# EAGLE design test-board-128-256 (EAGLE 8.3.2)
DESIGNER: JONNEW, MWL@MIT; DESIGN_NAME: 128/256 Channel Headstage Test Board; LICENSE: CERN OHL v1.2; REVISION: 1.0
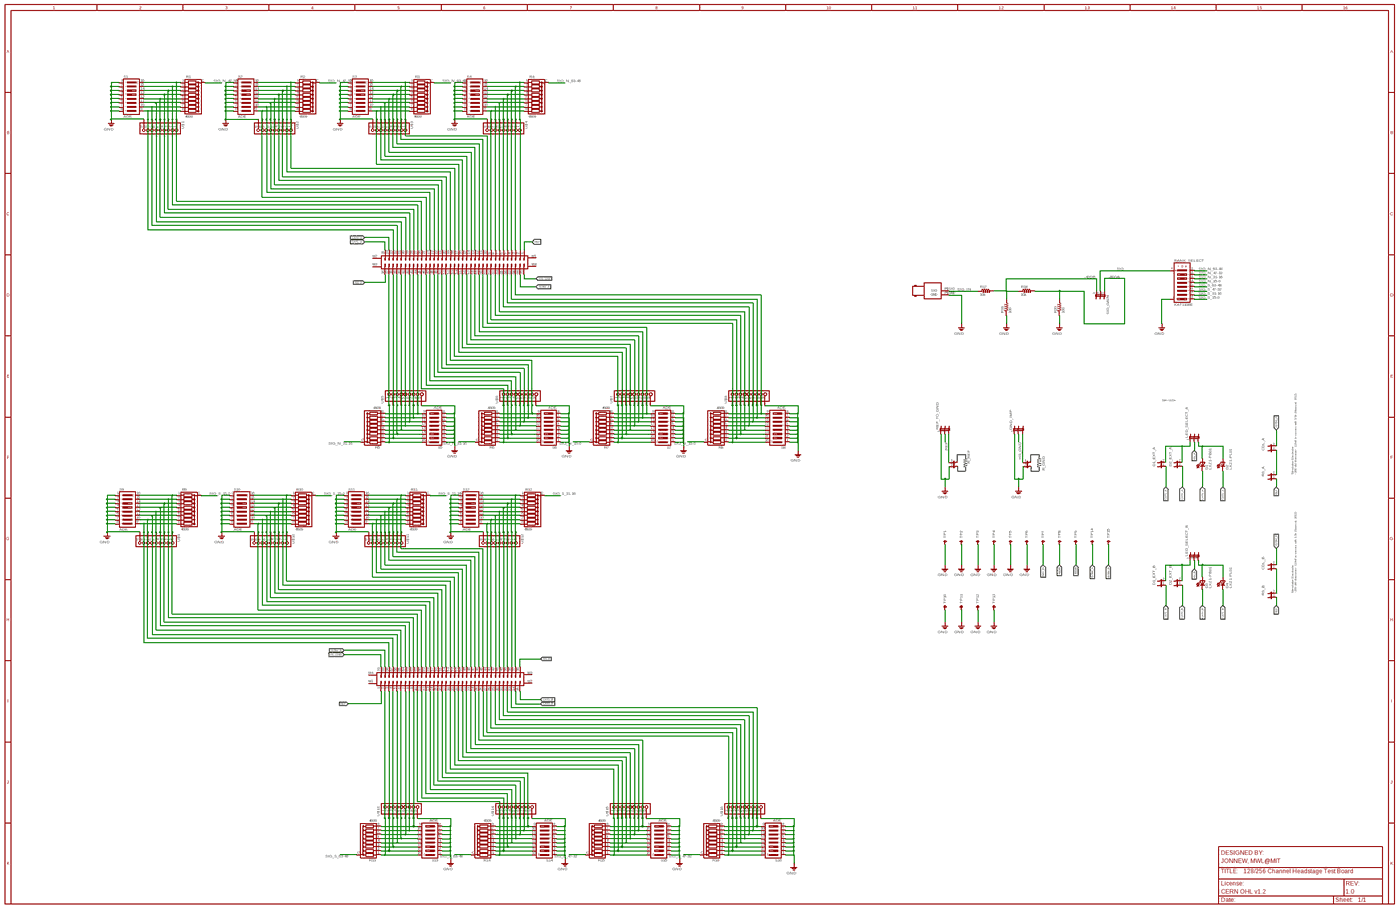
[diagram p0: schematic, sheet 1, overview]
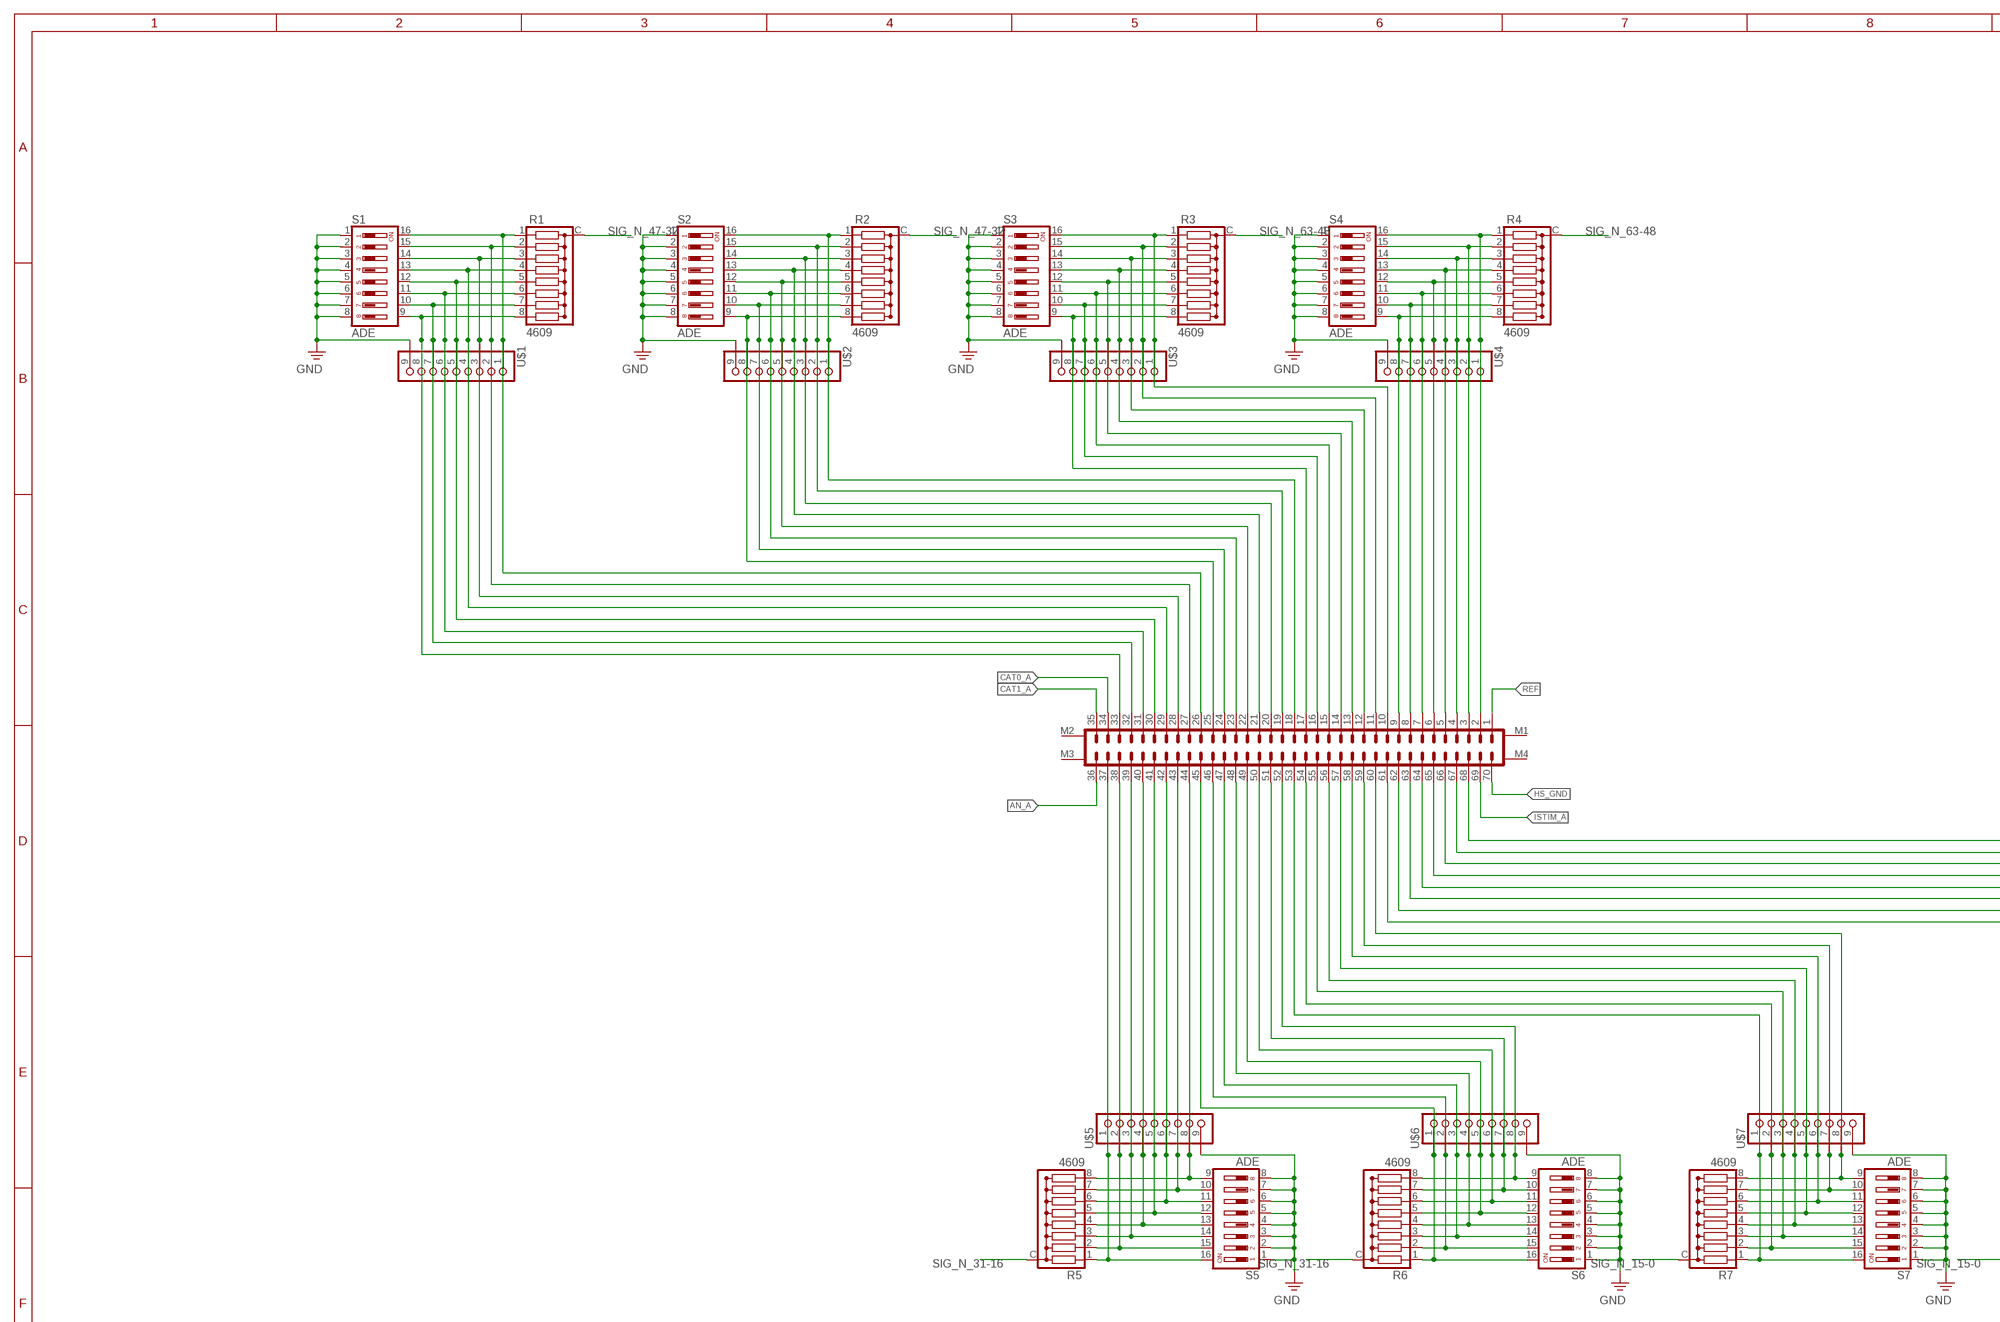
[diagram p1: schematic, sheet 1, part 1 of 4]
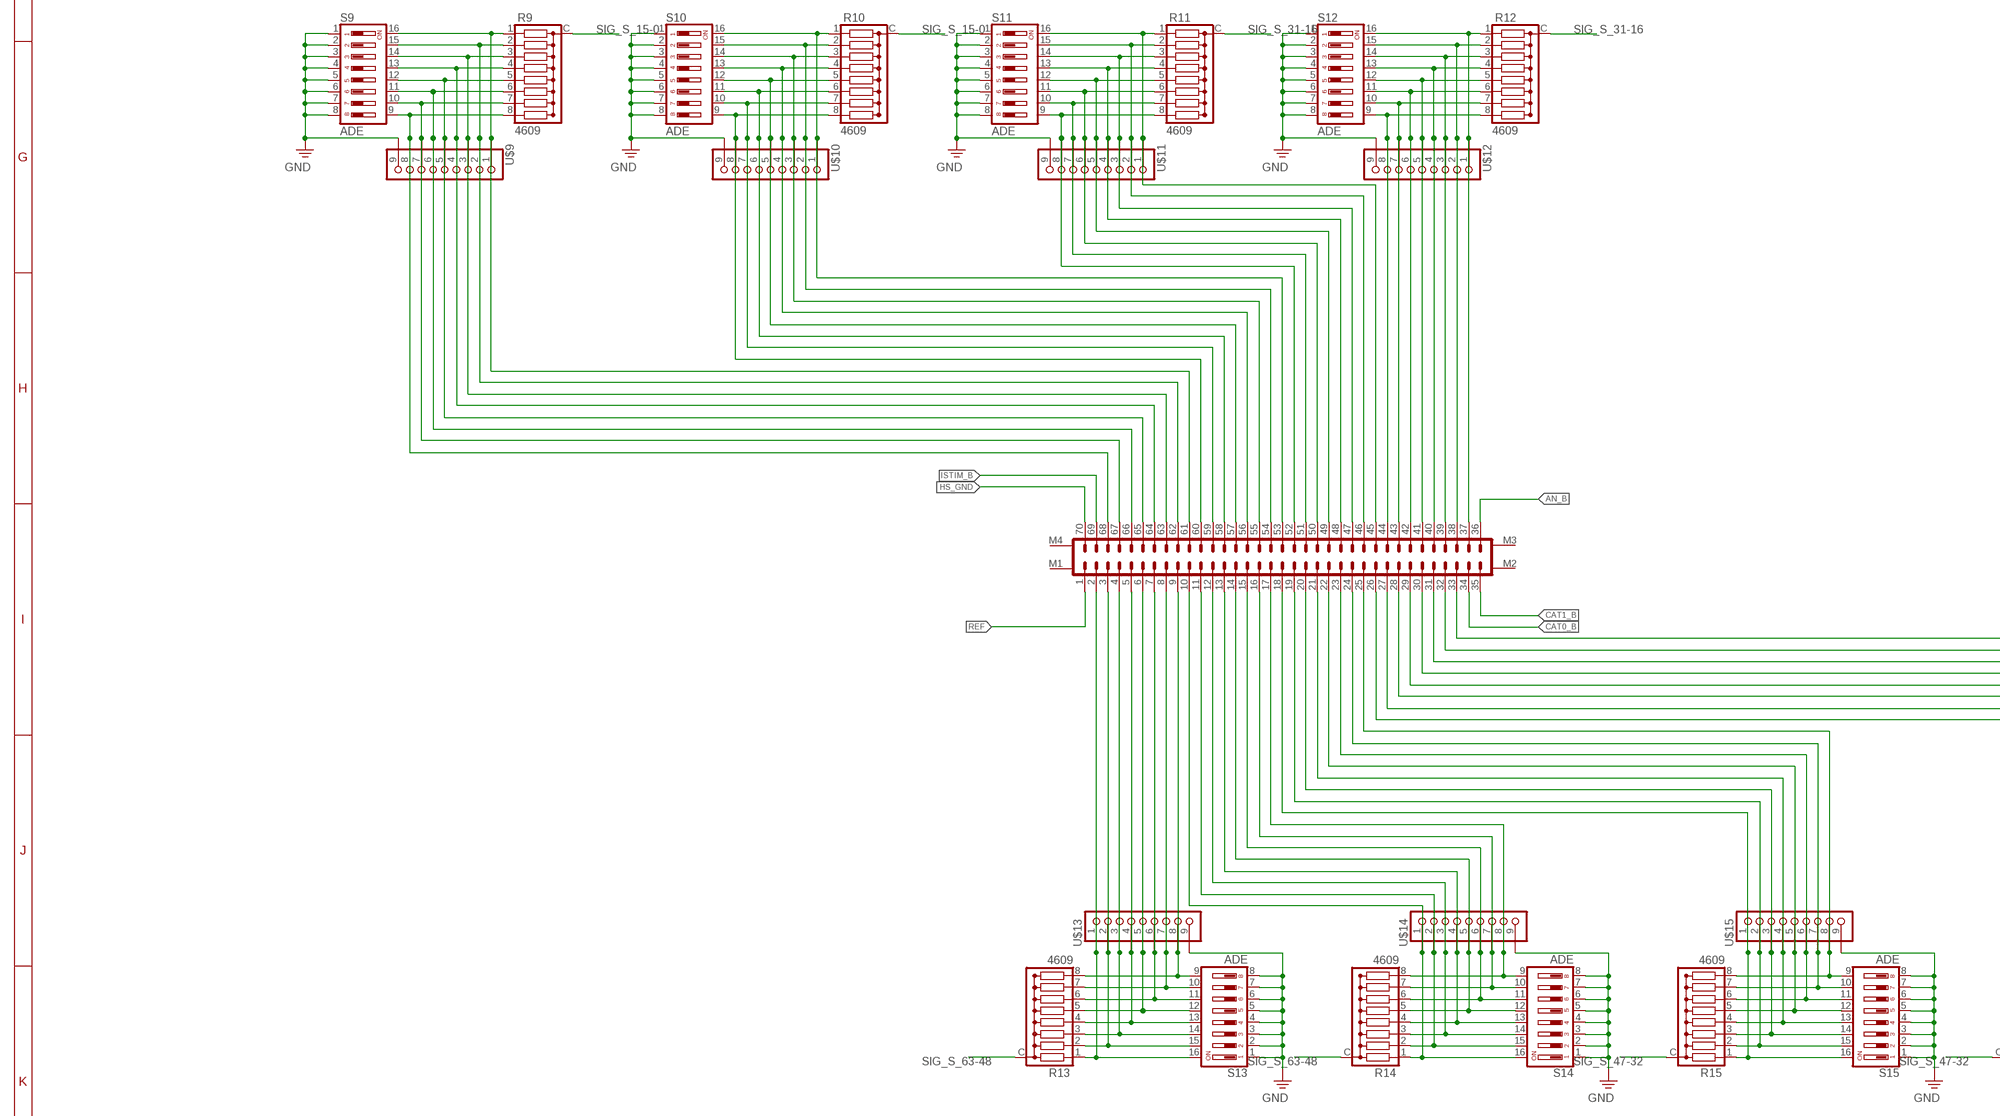
[diagram p2: schematic, sheet 1, part 2 of 4]
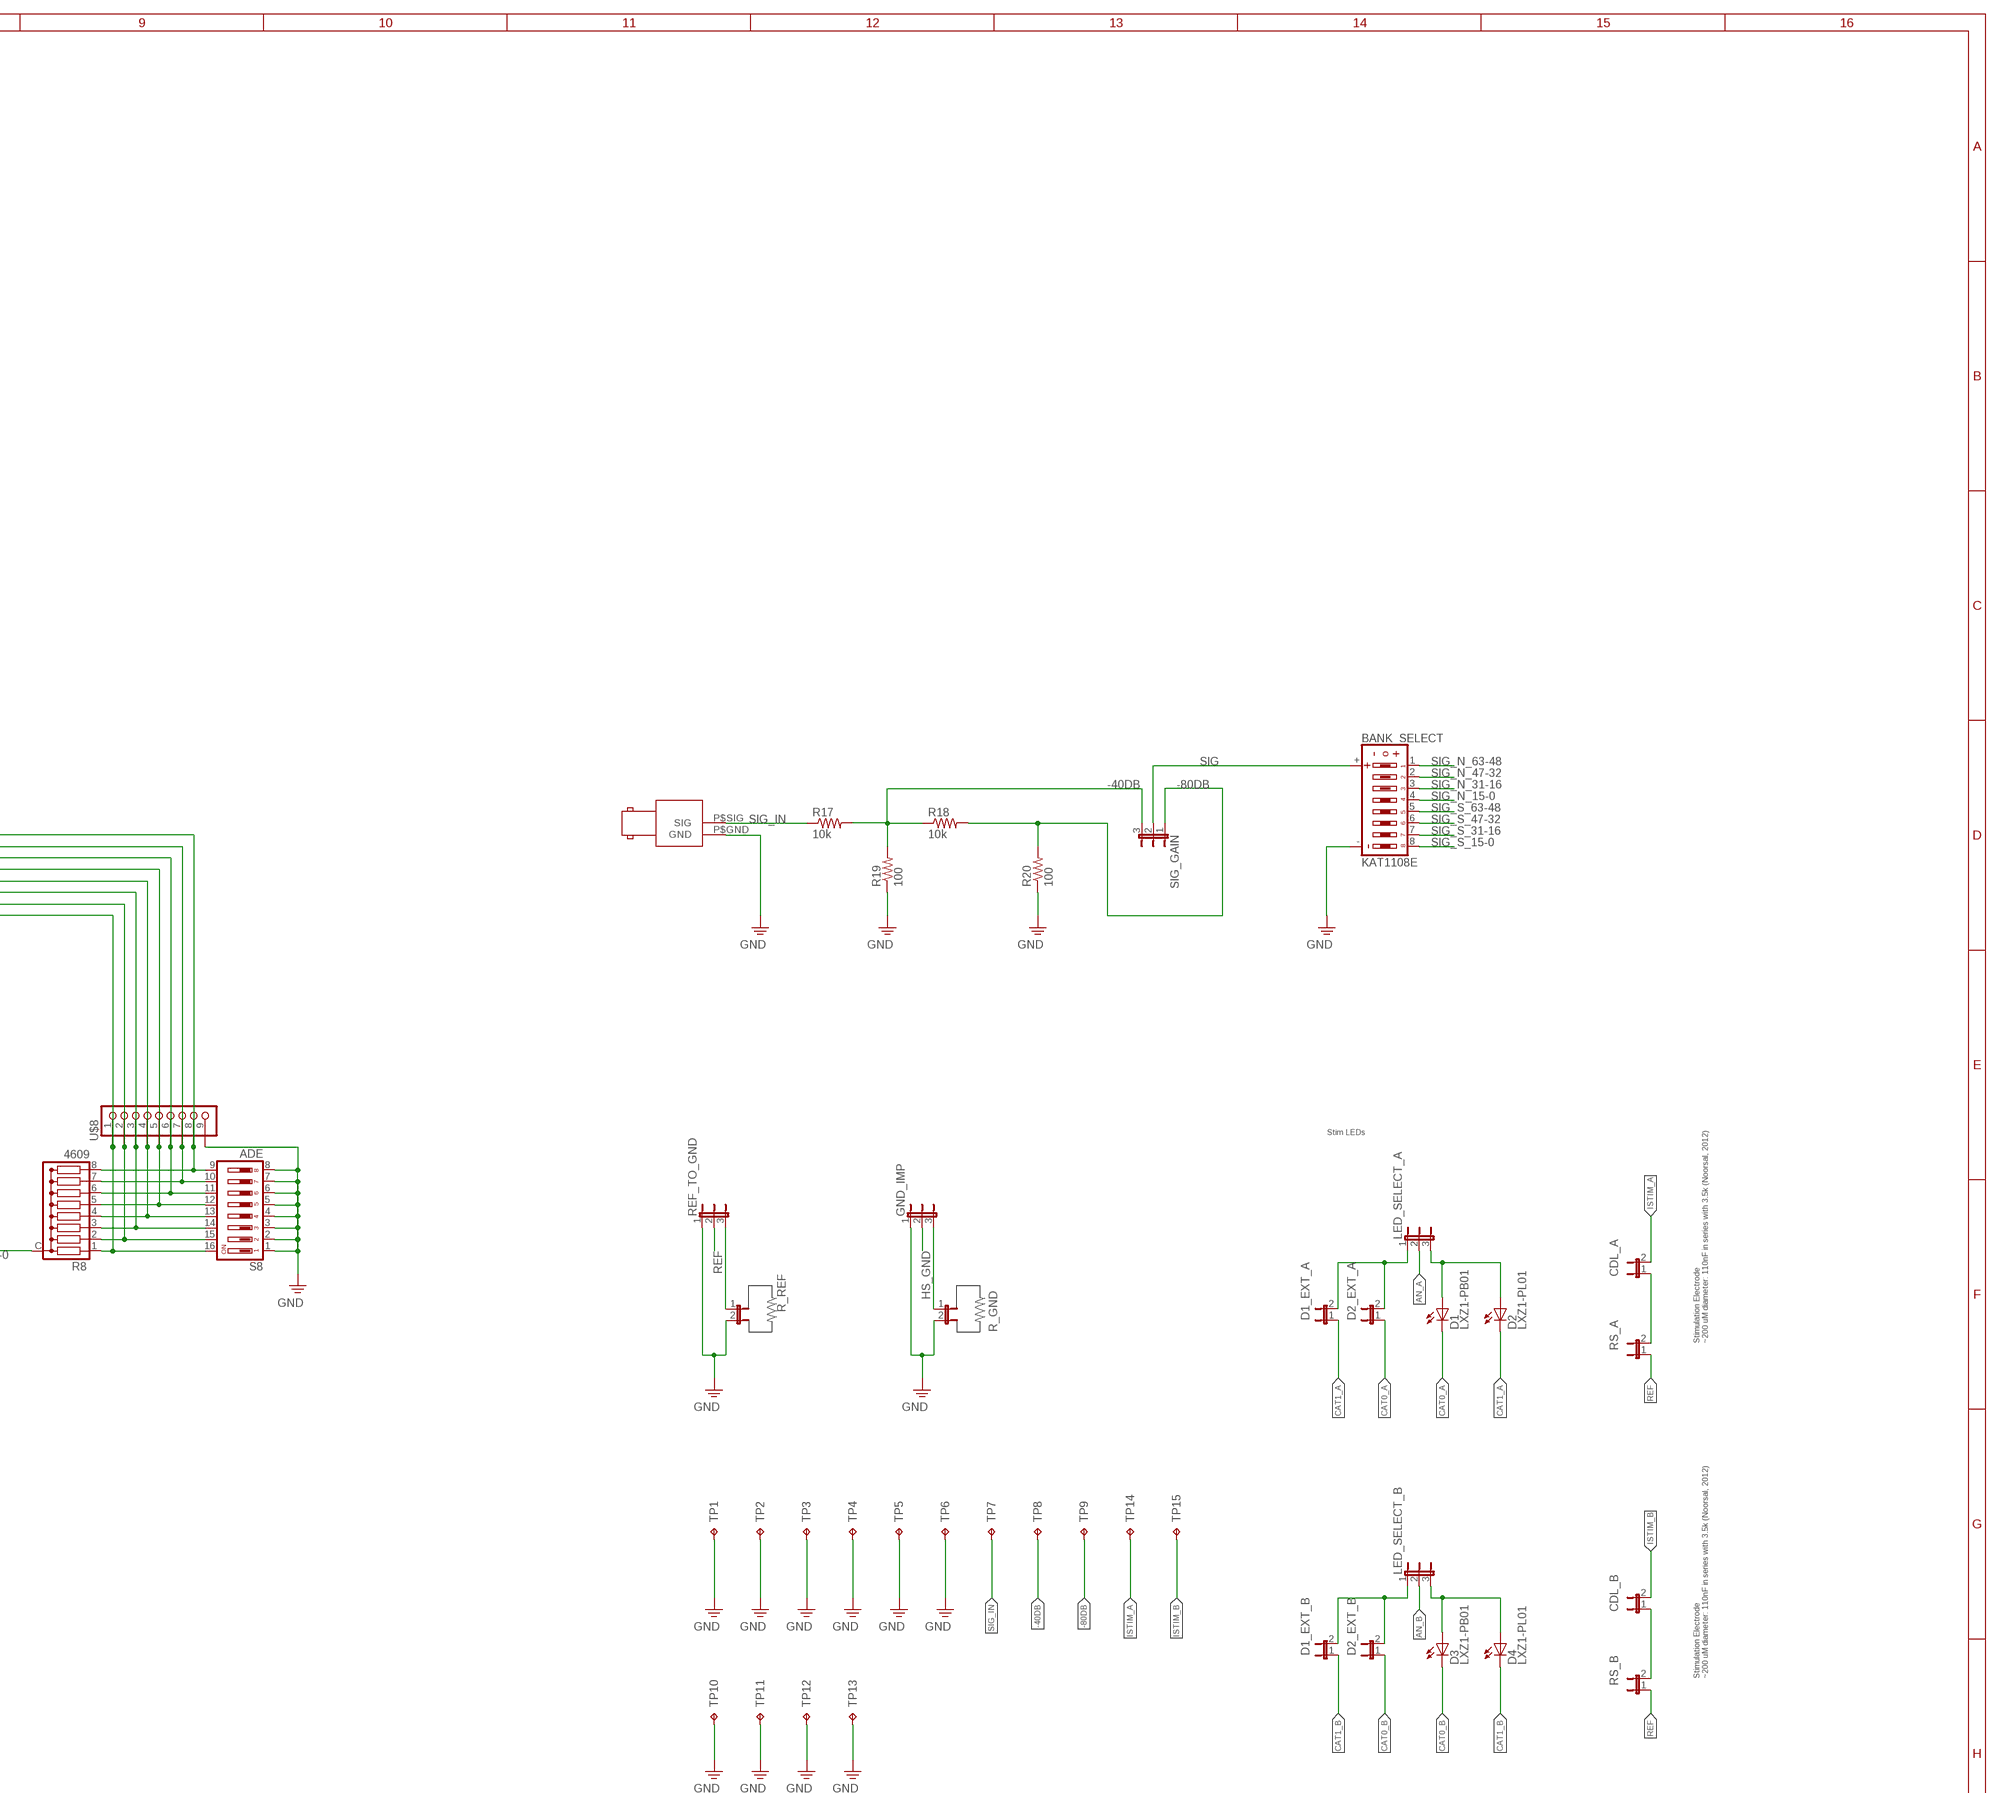
[diagram p3: schematic, sheet 1, part 3 of 4]
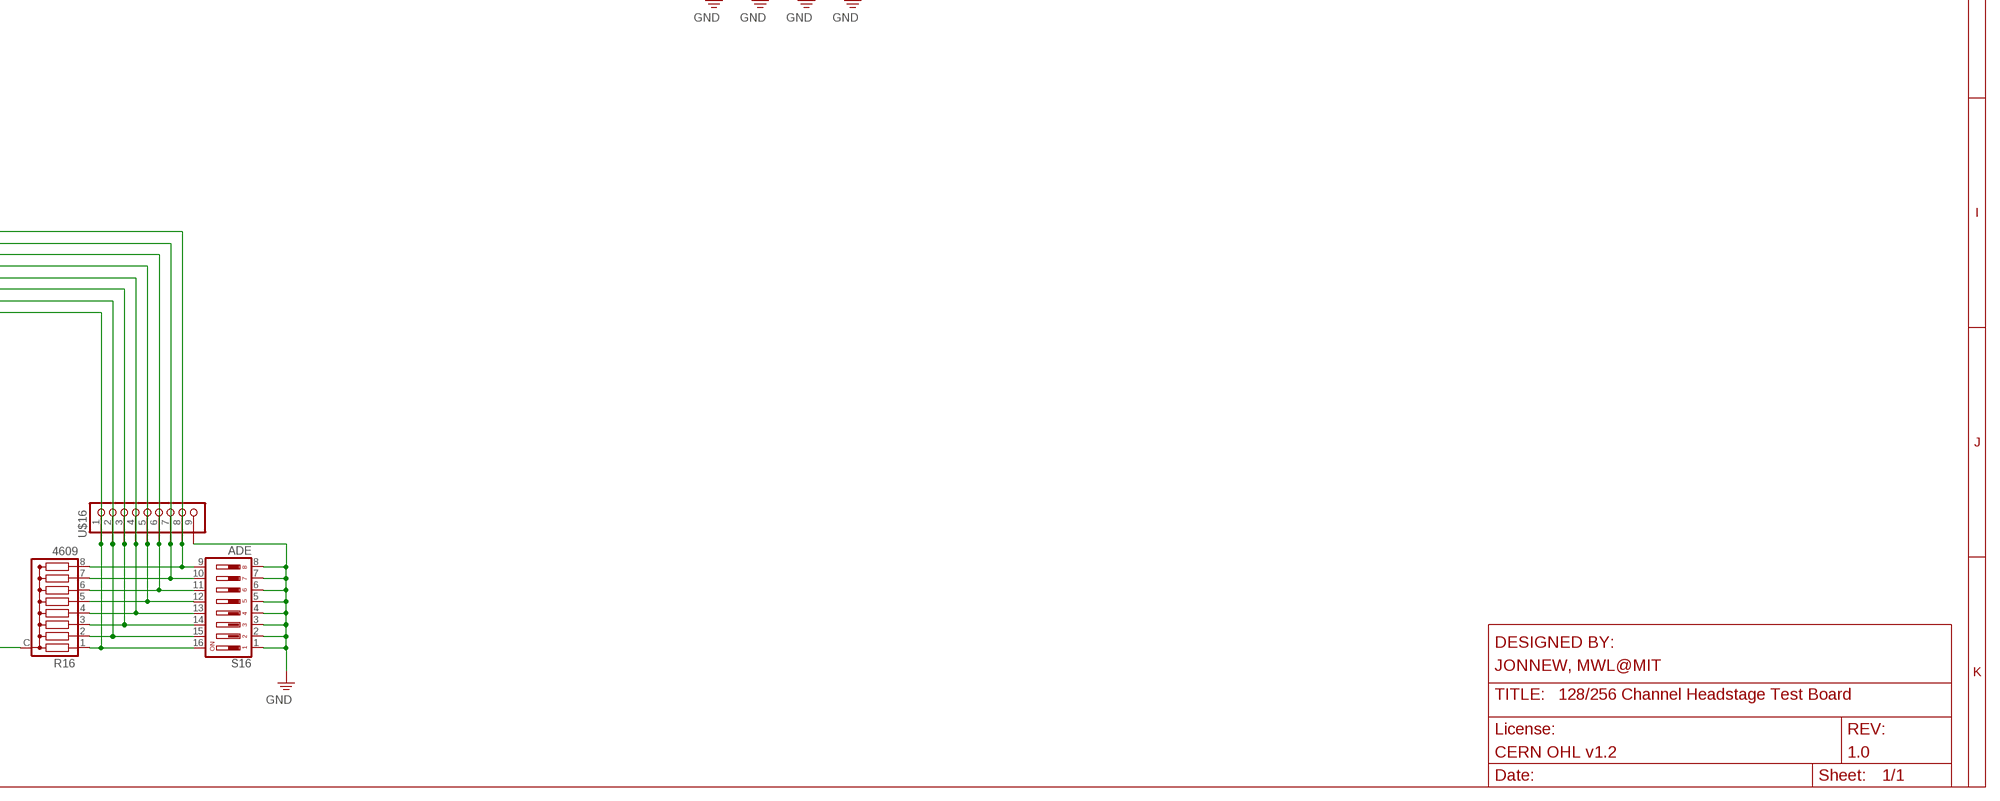
[diagram p4: schematic, sheet 1, part 4 of 4]

## Parts
A-OR-D  DF40HEAD  PINHD-2X35+4_DF40-70HEAD  [DF40-70HEAD]
B-OR-C  DF40HEAD  PINHD-2X35+4_DF40-70HEAD  [DF40-70HEAD]
BANK_SELECT  KAT1108E  DIPSW-008-SPDT_206-124  [206-124_DIP8-SPDT]
CDL_A  JP2E_THRU-HOLE  [JP2]
CDL_B  JP2E_THRU-HOLE  [JP2]
D1  LXZ1-PB01  LED_LXZ1  [LXZ1]
D1_EXT_A  JP2E_THRU-HOLE  [JP2]
D1_EXT_B  JP2E_THRU-HOLE  [JP2]
D2  LXZ1-PL01  LED_LXZ1  [LXZ1]
D2_EXT_A  JP2E_THRU-HOLE  [JP2]
D2_EXT_B  JP2E_THRU-HOLE  [JP2]
D3  LXZ1-PB01  LED_LXZ1  [LXZ1]
D4  LXZ1-PL01  LED_LXZ1  [LXZ1]
GND_IMP  JP3E  [JP3]
LED_SELECT_A  JP3E  [JP3]
LED_SELECT_B  JP3E  [JP3]
R1  4609  RN1X8  [RNX8-0.1]
R2  4609  RN1X8  [RNX8-0.1]
R3  4609  RN1X8  [RNX8-0.1]
R4  4609  RN1X8  [RNX8-0.1]
R5  4609  RN1X8  [RNX8-0.1]
R6  4609  RN1X8  [RNX8-0.1]
R7  4609  RN1X8  [RNX8-0.1]
R8  4609  RN1X8  [RNX8-0.1]
R9  4609  RN1X8  [RNX8-0.1]
R10  4609  RN1X8  [RNX8-0.1]
R11  4609  RN1X8  [RNX8-0.1]
R12  4609  RN1X8  [RNX8-0.1]
R13  4609  RN1X8  [RNX8-0.1]
R14  4609  RN1X8  [RNX8-0.1]
R15  4609  RN1X8  [RNX8-0.1]
R16  4609  RN1X8  [RNX8-0.1]
R17  10k  R_0805  [0805]
R18  10k  R_0805  [0805]
R19  100  R_0805  [0805]
R20  100  R_0805  [0805]
R_GND  JP2E_THRU-HOLE  [JP2]
R_REF  JP2E_THRU-HOLE  [JP2]
REF_TO_GND  JP3E  [JP3]
RS_A  JP2E_THRU-HOLE  [JP2]
RS_B  JP2E_THRU-HOLE  [JP2]
S1  ADE  DIPSW-008_ADE  [ADE_DIP8-SPST]
S2  ADE  DIPSW-008_ADE  [ADE_DIP8-SPST]
S3  ADE  DIPSW-008_ADE  [ADE_DIP8-SPST]
S4  ADE  DIPSW-008_ADE  [ADE_DIP8-SPST]
S5  ADE  DIPSW-008_ADE  [ADE_DIP8-SPST]
S6  ADE  DIPSW-008_ADE  [ADE_DIP8-SPST]
S7  ADE  DIPSW-008_ADE  [ADE_DIP8-SPST]
S8  ADE  DIPSW-008_ADE  [ADE_DIP8-SPST]
S9  ADE  DIPSW-008_ADE  [ADE_DIP8-SPST]
S10  ADE  DIPSW-008_ADE  [ADE_DIP8-SPST]
S11  ADE  DIPSW-008_ADE  [ADE_DIP8-SPST]
S12  ADE  DIPSW-008_ADE  [ADE_DIP8-SPST]
S13  ADE  DIPSW-008_ADE  [ADE_DIP8-SPST]
S14  ADE  DIPSW-008_ADE  [ADE_DIP8-SPST]
S15  ADE  DIPSW-008_ADE  [ADE_DIP8-SPST]
S16  ADE  DIPSW-008_ADE  [ADE_DIP8-SPST]
SIG_GAIN  JP3E  [JP3]
SIG_IN  1-1634622-0  BNC_RIGHT_ANGLE  [BNC_RIGHT_ANGLE]
TP1  GND  TPPAD1-20  [P1-20]
TP2  GND  TPPAD1-20  [P1-20]
TP3  GND  TPPAD1-20  [P1-20]
TP4  GND  TPPAD1-20  [P1-20]
TP5  GND  TPPAD1-20  [P1-20]
TP6  GND  TPPAD1-20  [P1-20]
TP7  SIG_IN  TPPAD1-20  [P1-20]
TP8  -40dB  TPPAD1-20  [P1-20]
TP9  -80dB  TPPAD1-20  [P1-20]
TP10  TP_4-40  [4-40_PLATED]
TP11  TP_4-40  [4-40_PLATED]
TP12  TP_4-40  [4-40_PLATED]
TP13  TP_4-40  [4-40_PLATED]
TP14  V_ISTIM_A  TPPAD1-20  [P1-20]
TP15  V_ISTIM_B  TPPAD1-20  [P1-20]
U$1  PINHD-1X9  [1X09]
U$2  PINHD-1X9  [1X09]
U$3  PINHD-1X9  [1X09]
U$4  PINHD-1X9  [1X09]
U$5  PINHD-1X9  [1X09]
U$6  PINHD-1X9  [1X09]
U$7  PINHD-1X9  [1X09]
U$8  PINHD-1X9  [1X09]
U$9  PINHD-1X9  [1X09]
U$10  PINHD-1X9  [1X09]
U$11  PINHD-1X9  [1X09]
U$12  PINHD-1X9  [1X09]
U$13  PINHD-1X9  [1X09]
U$14  PINHD-1X9  [1X09]
U$15  PINHD-1X9  [1X09]
U$16  PINHD-1X9  [1X09]

## Nets
-40DB: R17.2 R18.1 R19.2 SIG_GAIN.3 TP8.TP
-80DB: R18.2 R20.2 SIG_GAIN.1 TP9.TP
AN_A: A-OR-D.36 LED_SELECT_A.2
AN_B: B-OR-C.36 LED_SELECT_B.2
AN_INT: D1.A D2.A LED_SELECT_A.3
AN_INT1: D3.A D4.A LED_SELECT_B.3
CAT0_A: A-OR-D.34 D1.C D2_EXT_A.1
CAT0_B: B-OR-C.34 D2_EXT_B.1 D3.C
CAT1_A: A-OR-D.35 D1_EXT_A.1 D2.C
CAT1_B: B-OR-C.35 D1_EXT_B.1 D4.C
GND: BANK_SELECT.- GND_IMP.1 R19.1 R20.1 R_GND.2 R_REF.2 REF_TO_GND.1 S1.1 S1.2 S1.3 S1.4 S1.5 S1.6 S1.7 S1.8 S2.1 S2.2 S2.3 S2.4 S2.5 S2.6 S2.7 S2.8 S3.1 S3.2 S3.3 S3.4 S3.5 S3.6 S3.7 S3.8 S4.1 S4.2 S4.3 S4.4 S4.5 S4.6 S4.7 S4.8 S5.1 S5.2 S5.3 S5.4 S5.5 S5.6 S5.7 S5.8 S6.1 S6.2 S6.3 S6.4 S6.5 S6.6 S6.7 S6.8 S7.1 S7.2 S7.3 S7.4 S7.5 S7.6 S7.7 S7.8 S8.1 S8.2 S8.3 S8.4 S8.5 S8.6 S8.7 S8.8 S9.1 S9.2 S9.3 S9.4 S9.5 S9.6 S9.7 S9.8 S10.1 S10.2 S10.3 S10.4 S10.5 S10.6 S10.7 S10.8 S11.1 S11.2 S11.3 S11.4 S11.5 S11.6 S11.7 S11.8 S12.1 S12.2 S12.3 S12.4 S12.5 S12.6 S12.7 S12.8 S13.1 S13.2 S13.3 S13.4 S13.5 S13.6 S13.7 S13.8 S14.1 S14.2 S14.3 S14.4 S14.5 S14.6 S14.7 S14.8 S15.1 S15.2 S15.3 S15.4 S15.5 S15.6 S15.7 S15.8 S16.1 S16.2 S16.3 S16.4 S16.5 S16.6 S16.7 S16.8 SIG_IN.P$GND(GND) TP1.TP TP2.TP TP3.TP TP4.TP TP5.TP TP6.TP TP10.P$1(TP) TP11.P$1(TP) TP12.P$1(TP) TP13.P$1(TP) U$1.9 U$2.9 U$3.9 U$4.9 U$5.9 U$6.9 U$7.9 U$8.9 U$9.9 U$10.9 U$11.9 U$12.9 U$13.9 U$14.9 U$15.9 U$16.9
HS_GND: A-OR-D.70 B-OR-C.70 GND_IMP.2
ISTIM_A: A-OR-D.69 CDL_A.2 TP14.TP
ISTIM_B: B-OR-C.69 CDL_B.2 TP15.TP
N$1: CDL_A.1 RS_A.2
N$2: GND_IMP.3 R_GND.1
N$3: B-OR-C.3 R13.2 S13.15 U$13.2
N$4: B-OR-C.5 R13.4 S13.13 U$13.4
N$5: D1_EXT_A.2 D2_EXT_A.2 LED_SELECT_A.1
N$6: A-OR-D.17 R3.8 S3.9 U$3.8
N$7: A-OR-D.9 R4.8 S4.9 U$4.8
N$8: A-OR-D.15 R3.6 S3.11 U$3.6
N$9: A-OR-D.14 R3.5 S3.12 U$3.5
N$10: A-OR-D.3 R4.2 S4.15 U$4.2
N$11: A-OR-D.12 R3.3 S3.14 U$3.3
N$12: A-OR-D.4 R4.3 S4.14 U$4.3
N$13: A-OR-D.10 R3.1 S3.16 U$3.1
N$14: CDL_B.1 RS_B.2
N$16: D1_EXT_B.2 D2_EXT_B.2 LED_SELECT_B.1
N$18: A-OR-D.7 R4.6 S4.11 U$4.6
N$19: A-OR-D.8 R4.7 S4.10 U$4.7
N$20: A-OR-D.6 R4.5 S4.12 U$4.5
N$21: A-OR-D.2 R4.1 S4.16 U$4.1
N$23: A-OR-D.27 R1.2 S1.15 U$1.2
N$24: A-OR-D.29 R1.4 S1.13 U$1.4
N$25: A-OR-D.43 R5.7 S5.10 U$5.7
N$26: B-OR-C.7 R13.6 S13.11 U$13.6
N$27: A-OR-D.32 R1.7 S1.10 U$1.7
N$28: R_REF.1 REF_TO_GND.3
N$29: A-OR-D.30 R1.5 S1.12 U$1.5
N$30: A-OR-D.41 R5.5 S5.12 U$5.5
N$31: A-OR-D.28 R1.3 S1.14 U$1.3
N$32: B-OR-C.9 R13.8 S13.9 U$13.8
N$33: A-OR-D.39 R5.3 S5.14 U$5.3
N$34: A-OR-D.31 R1.6 S1.11 U$1.6
N$35: B-OR-C.10 R14.1 S14.16 U$14.1
N$36: A-OR-D.33 R1.8 S1.9 U$1.8
N$37: A-OR-D.37 R5.1 S5.16 U$5.1
N$38: A-OR-D.19 R2.2 S2.15 U$2.2
N$39: A-OR-D.52 R6.8 S6.9 U$6.8
N$40: A-OR-D.21 R2.4 S2.13 U$2.4
N$41: B-OR-C.11 R14.2 S14.15 U$14.2
N$42: A-OR-D.23 R2.6 S2.11 U$2.6
N$43: A-OR-D.24 R2.7 S2.10 U$2.7
N$45: B-OR-C.14 R14.5 S14.12 U$14.5
N$46: B-OR-C.15 R14.6 S14.11 U$14.6
N$47: A-OR-D.47 R6.3 S6.14 U$6.3
N$48: B-OR-C.16 R14.7 S14.10 U$14.7
N$49: B-OR-C.19 R15.2 S15.15 U$15.2
N$50: B-OR-C.20 R15.3 S15.14 U$15.3
N$51: B-OR-C.21 R15.4 S15.13 U$15.4
N$52: B-OR-C.22 R15.5 S15.12 U$15.5
N$53: B-OR-C.23 R15.6 S15.11 U$15.6
N$54: B-OR-C.24 R15.7 S15.10 U$15.7
N$55: B-OR-C.25 R15.8 S15.9 U$15.8
N$56: B-OR-C.26 R16.1 S16.16 U$16.1
N$57: A-OR-D.53 R7.1 S7.16 U$7.1
N$58: B-OR-C.27 R16.2 S16.15 U$16.2
N$59: B-OR-C.28 R16.3 S16.14 U$16.3
N$60: B-OR-C.29 R16.4 S16.13 U$16.4
N$61: B-OR-C.30 R16.5 S16.12 U$16.5
N$62: B-OR-C.31 R16.6 S16.11 U$16.6
N$63: B-OR-C.32 R16.7 S16.10 U$16.7
N$64: B-OR-C.33 R16.8 S16.9 U$16.8
N$65: B-OR-C.8 R13.7 S13.10 U$13.7
N$66: B-OR-C.6 R13.5 S13.12 U$13.5
N$67: B-OR-C.4 R13.3 S13.14 U$13.3
N$68: B-OR-C.2 R13.1 S13.16 U$13.1
N$69: B-OR-C.17 R14.8 S14.9 U$14.8
N$70: B-OR-C.12 R14.3 S14.14 U$14.3
N$71: B-OR-C.18 R15.1 S15.16 U$15.1
N$72: B-OR-C.61 R9.1 S9.16 U$9.1
N$73: B-OR-C.60 R10.8 S10.9 U$10.8
N$74: B-OR-C.57 R10.5 S10.12 U$10.5
N$75: B-OR-C.55 R10.3 S10.14 U$10.3
N$76: B-OR-C.53 R10.1 S10.16 U$10.1
N$77: B-OR-C.51 R11.7 S11.10 U$11.7
N$78: B-OR-C.48 R11.4 S11.13 U$11.4
N$79: B-OR-C.46 R11.2 S11.15 U$11.2
N$80: B-OR-C.40 R12.4 S12.13 U$12.4
N$81: B-OR-C.52 R11.8 S11.9 U$11.8
N$82: B-OR-C.50 R11.6 S11.11 U$11.6
N$83: B-OR-C.49 R11.5 S11.12 U$11.5
N$84: B-OR-C.47 R11.3 S11.14 U$11.3
N$85: B-OR-C.45 R11.1 S11.16 U$11.1
N$86: B-OR-C.67 R9.7 S9.10 U$9.7
N$87: B-OR-C.65 R9.5 S9.12 U$9.5
N$88: B-OR-C.63 R9.3 S9.14 U$9.3
N$89: B-OR-C.44 R12.8 S12.9 U$12.8
N$90: B-OR-C.38 R12.2 S12.15 U$12.2
N$91: B-OR-C.39 R12.3 S12.14 U$12.3
N$92: B-OR-C.42 R12.6 S12.11 U$12.6
N$93: B-OR-C.43 R12.7 S12.10 U$12.7
N$94: B-OR-C.41 R12.5 S12.12 U$12.5
N$95: B-OR-C.37 R12.1 S12.16 U$12.1
N$97: B-OR-C.64 R9.4 S9.13 U$9.4
N$98: B-OR-C.66 R9.6 S9.11 U$9.6
N$99: B-OR-C.68 R9.8 S9.9 U$9.8
N$100: B-OR-C.54 R10.2 S10.15 U$10.2
N$101: B-OR-C.56 R10.4 S10.13 U$10.4
N$102: B-OR-C.58 R10.6 S10.11 U$10.6
N$103: B-OR-C.59 R10.7 S10.10 U$10.7
N$110: B-OR-C.13 R14.4 S14.13 U$14.4
N$130: B-OR-C.62 R9.2 S9.15 U$9.2
N$206: A-OR-D.26 R1.1 S1.16 U$1.1
N$207: A-OR-D.25 R2.8 S2.9 U$2.8
N$210: A-OR-D.22 R2.5 S2.12 U$2.5
N$212: A-OR-D.20 R2.3 S2.14 U$2.3
N$214: A-OR-D.18 R2.1 S2.16 U$2.1
N$216: A-OR-D.16 R3.7 S3.10 U$3.7
N$219: A-OR-D.13 R3.4 S3.13 U$3.4
N$221: A-OR-D.11 R3.2 S3.15 U$3.2
N$230: A-OR-D.5 R4.4 S4.13 U$4.4
N$231: A-OR-D.38 R5.2 S5.15 U$5.2
N$233: A-OR-D.40 R5.4 S5.13 U$5.4
N$235: A-OR-D.42 R5.6 S5.11 U$5.6
N$237: A-OR-D.44 R5.8 S5.9 U$5.8
N$238: A-OR-D.45 R6.1 S6.16 U$6.1
N$239: A-OR-D.46 R6.2 S6.15 U$6.2
N$241: A-OR-D.48 R6.4 S6.13 U$6.4
N$242: A-OR-D.49 R6.5 S6.12 U$6.5
N$243: A-OR-D.50 R6.6 S6.11 U$6.6
N$245: A-OR-D.51 R6.7 S6.10 U$6.7
N$247: A-OR-D.54 R7.2 S7.15 U$7.2
N$248: A-OR-D.55 R7.3 S7.14 U$7.3
N$249: A-OR-D.56 R7.4 S7.13 U$7.4
N$250: A-OR-D.57 R7.5 S7.12 U$7.5
N$251: A-OR-D.58 R7.6 S7.11 U$7.6
N$252: A-OR-D.59 R7.7 S7.10 U$7.7
N$253: A-OR-D.60 R7.8 S7.9 U$7.8
N$254: A-OR-D.61 R8.1 S8.16 U$8.1
N$255: A-OR-D.62 R8.2 S8.15 U$8.2
N$256: A-OR-D.63 R8.3 S8.14 U$8.3
N$257: A-OR-D.64 R8.4 S8.13 U$8.4
N$258: A-OR-D.65 R8.5 S8.12 U$8.5
N$259: A-OR-D.66 R8.6 S8.11 U$8.6
N$260: A-OR-D.67 R8.7 S8.10 U$8.7
N$261: A-OR-D.68 R8.8 S8.9 U$8.8
REF: A-OR-D.1 B-OR-C.1 REF_TO_GND.2 RS_A.1 RS_B.1
SIG: BANK_SELECT.+ SIG_GAIN.2
SIG_IN: R17.1 SIG_IN.P$SIG(SIG) TP7.TP
SIG_N_15-0: BANK_SELECT.4 R7.C R8.C
SIG_N_31-16: BANK_SELECT.3 R5.C R6.C
SIG_N_47-32: BANK_SELECT.2 R1.C R2.C
SIG_N_63-48: BANK_SELECT.1 R3.C R4.C
SIG_S_15-0: BANK_SELECT.8 R9.C R10.C
SIG_S_31-16: BANK_SELECT.7 R11.C R12.C
SIG_S_47-32: BANK_SELECT.6 R15.C R16.C
SIG_S_63-48: BANK_SELECT.5 R13.C R14.C
Unconnected: A-OR-D.M1 A-OR-D.M2 A-OR-D.M3 A-OR-D.M4 B-OR-C.M1 B-OR-C.M2 B-OR-C.M3 B-OR-C.M4

## Notes on the sheet
- Stim LEDs
- Stimulation Electrode
  ~200 uM diameter: 110nF in series with 3.5k (Noorsal, 2012)
- Stimulation Electrode
  ~200 uM diameter: 110nF in series with 3.5k (Noorsal, 2012)

## Library data of the parts
A-OR-D B-OR-C = jonnew:PINHD-2X35+4
BANK_SELECT = jonnew:DIPSW-008-SPDT
CDL_A CDL_B D1_EXT_A D1_EXT_B D2_EXT_A D2_EXT_B R_GND R_REF RS_A RS_B = jonnew:JP2E
D1-D4 = jonnew:LED: Surface mount LED
GND_IMP LED_SELECT_A LED_SELECT_B REF_TO_GND SIG_GAIN = jonnew:JP3E
R1-R16 = jonnew:RN1X8
R17-R20 = jonnew:R: Resistor
S1-S16 = jonnew:DIPSW-008
SIG_IN = josh:BNC_RIGHT_ANGLE
TP1-TP15 = jonnew:TP: Test pad
U$1-U$16 = test-board:PINHD-1X9

## Net classes
1 thick: width 0.102 mm

## Board
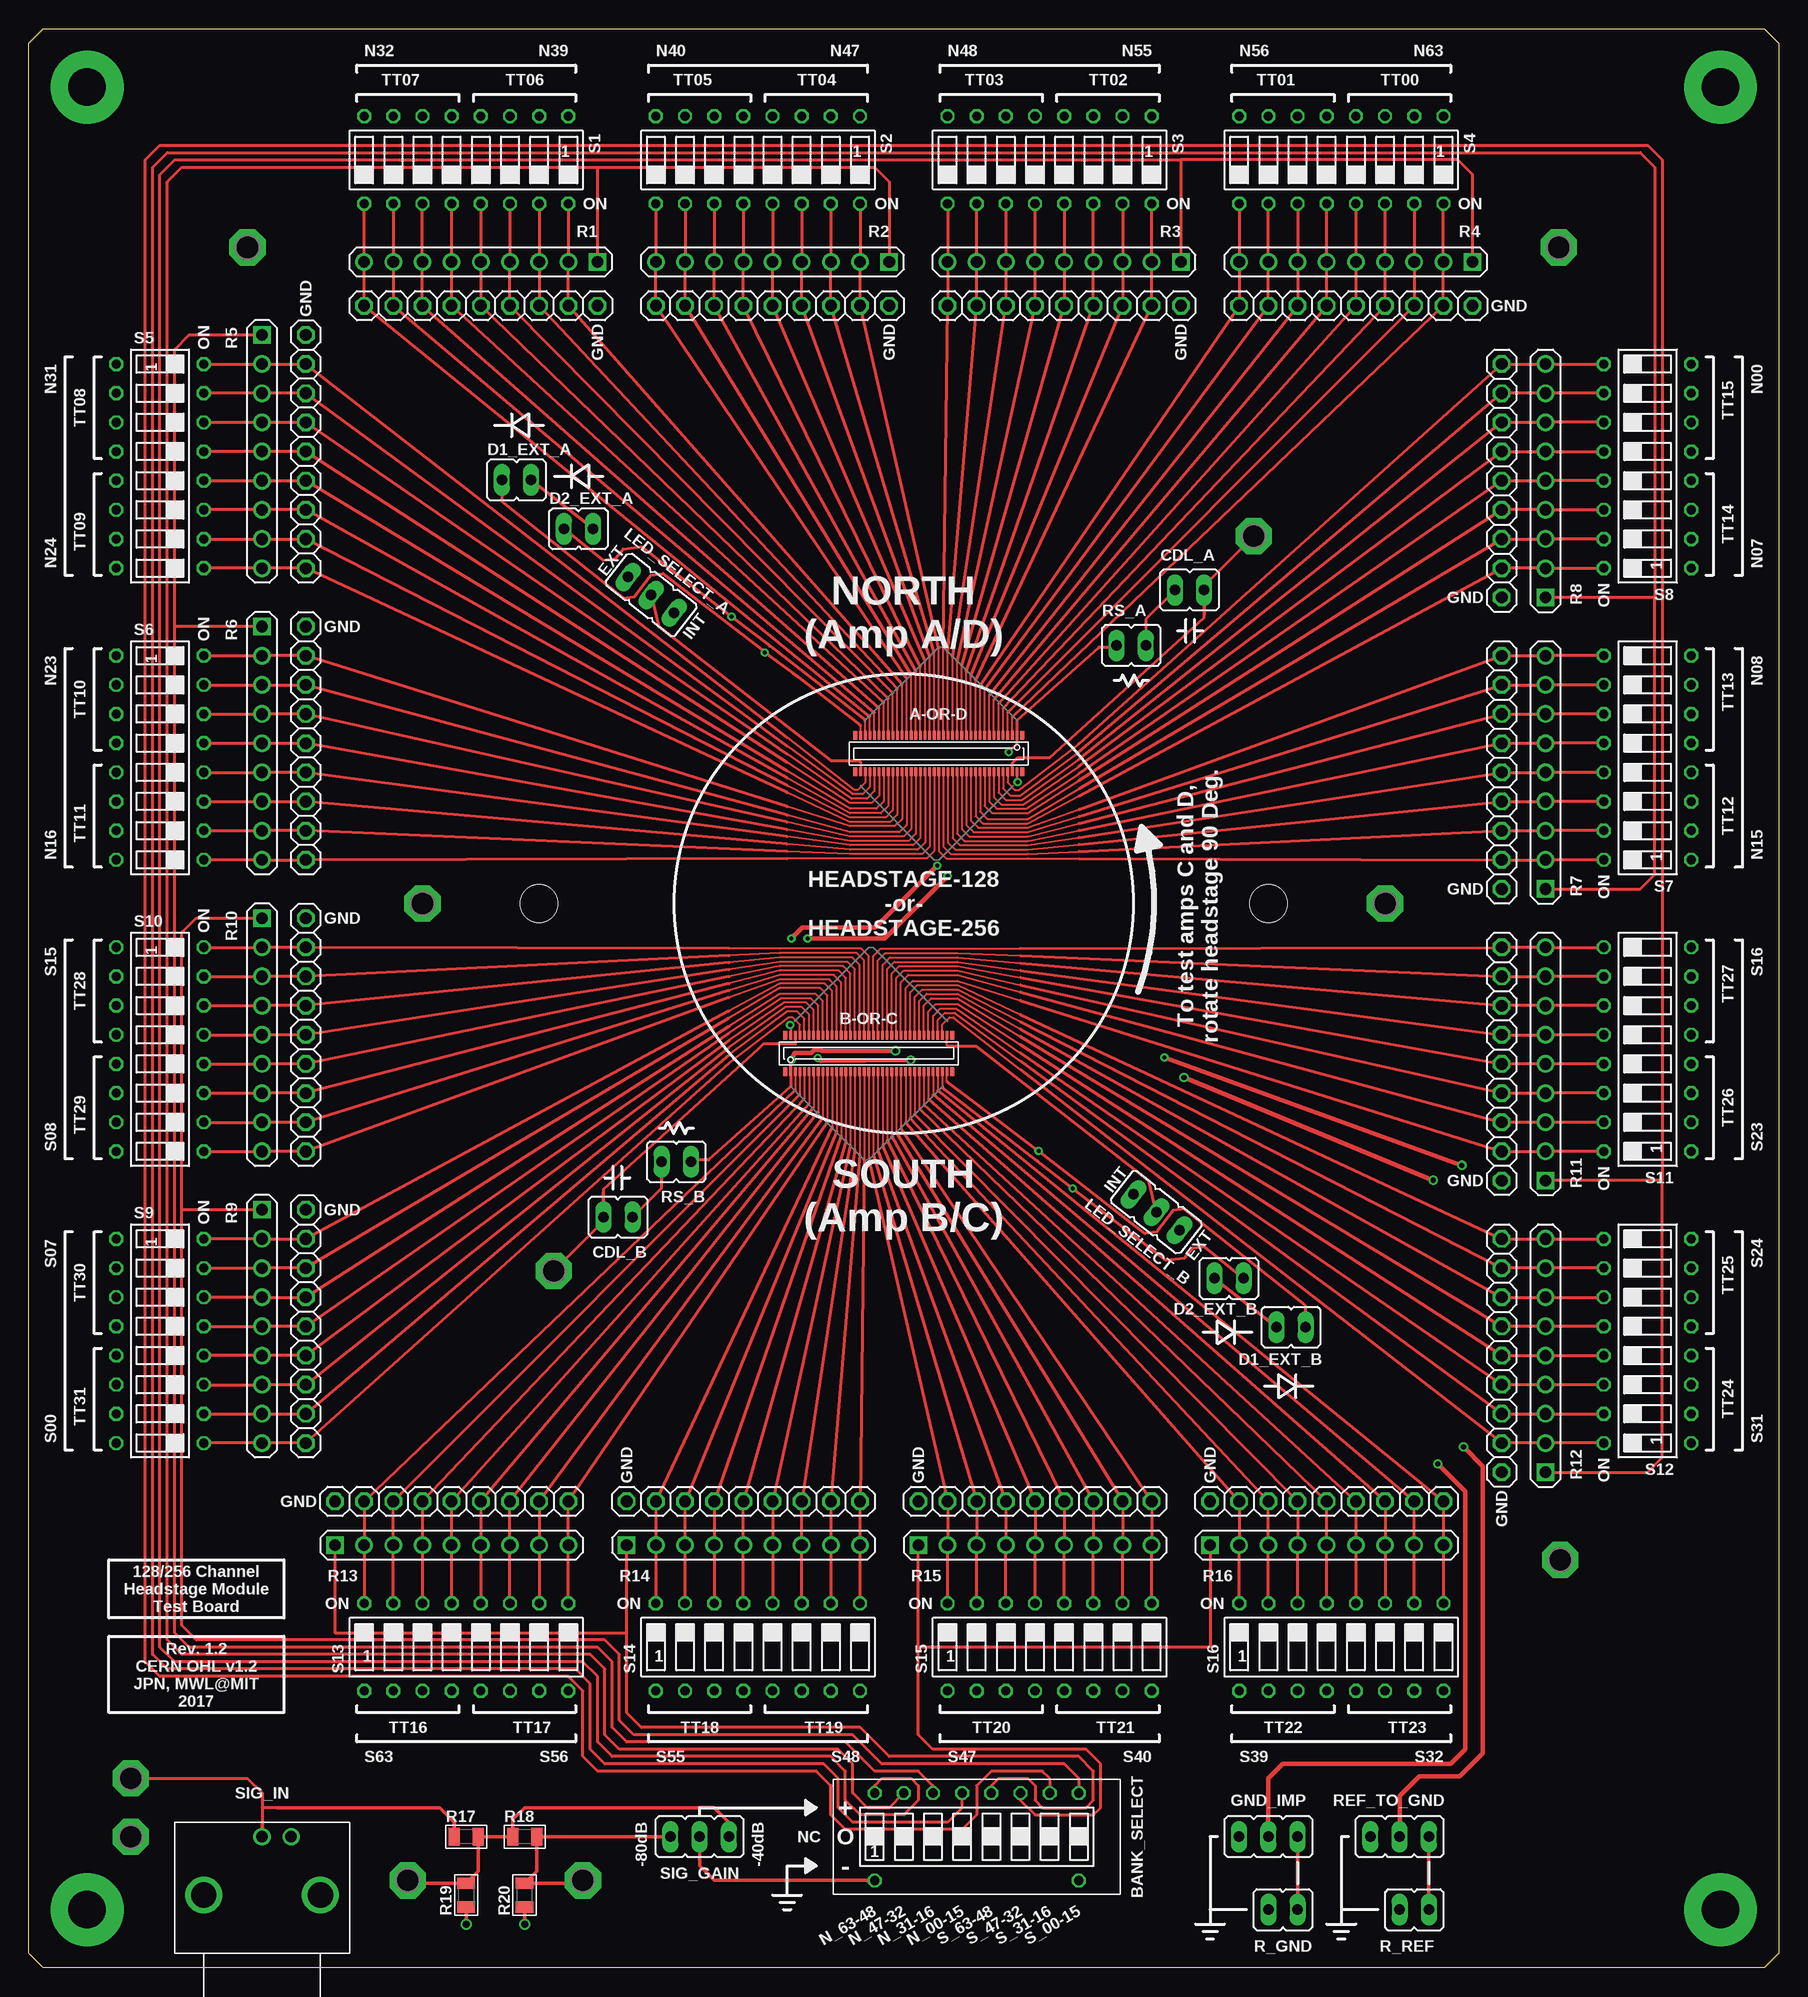
[diagram p5: board, top side]
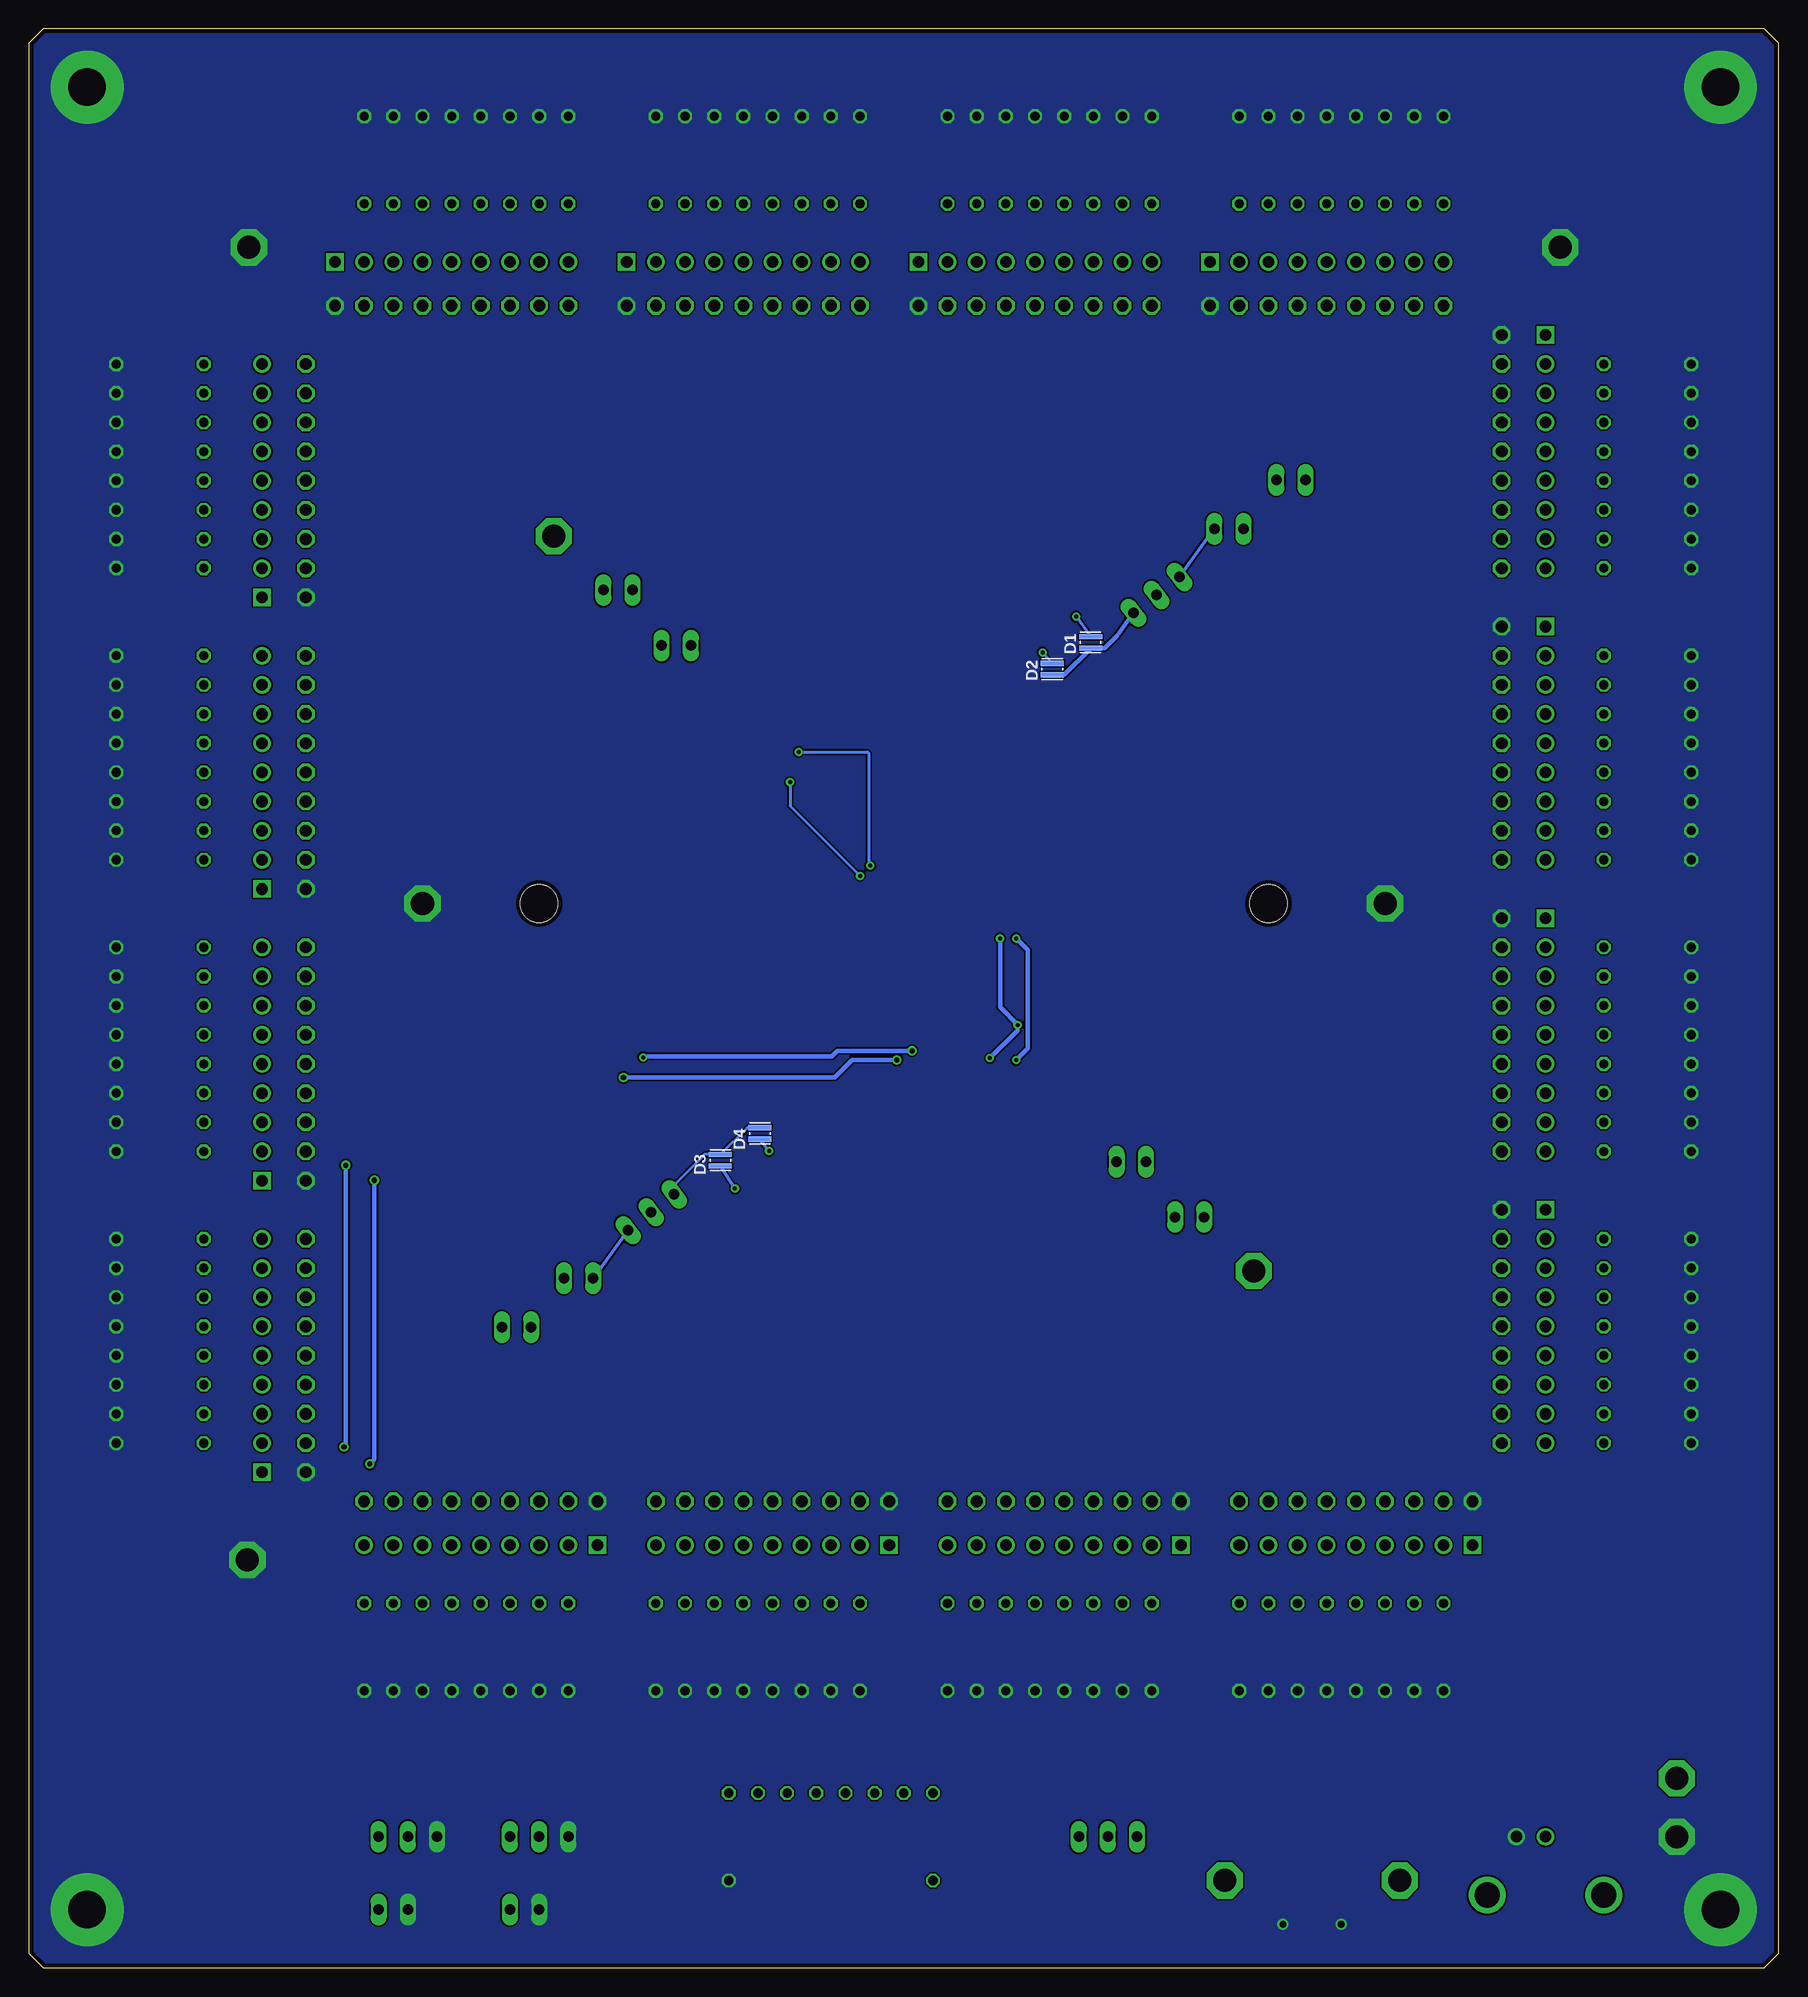
[diagram p6: board, bottom side, seen from below]

Size 152.4 x 168.91 mm. Coordinates in mm from the lower left corner, seen from the top.
Outline: 152.4,167.64 152.4,1.27 151.13,0 1.27,0 0,1.27 0,167.64 1.27,168.91 151.13,168.91 152.4,167.64
Copper layers (1*16): Top 0.0356mm / dielectric 1.5011mm / Bottom 0.0356mm
Design rules "ohs-park-2-layer": minimum track width 6mil, minimum drill 13mil, track to track 6mil, track to pad 6mil, pad to pad 6mil, via to via 6mil, smd to smd 6mil, copper to edge 15mil, drill to drill 6mil, minimum pad ring 7mil, minimum via ring 7mil, stop-mask expansion 4mil, vias tented up to drill 100mil, thermal gap 10mil
Holes 3.26 mm at 44.45,92.71 107.95,92.71

### Footprints (pad centres in the part's own frame; a part is rotated, then mirrored left to right if it is on the bottom)
DF40-70HEAD = smd 0.23 x 0.75: 1 -6.8,-1.585; 2 -6.4,-1.585; 3 -6,-1.585; 4 -5.6,-1.585; 5 -5.2,-1.585; 6 -4.8,-1.585; 7 -4.4,-1.585; 8 -4,-1.585; 9 -3.6,-1.585; 10 -3.2,-1.585; 11 -2.8,-1.585; 12 -2.4,-1.585; 13 -2,-1.585; 14 -1.6,-1.585; 15 -1.2,-1.585; 16 -0.8,-1.585; 17 -0.4,-1.585; 18 0,-1.585; 19 0.4,-1.585; 20 0.8,-1.585; 21 1.2,-1.585; 22 1.6,-1.585; 23 2,-1.585; 24 2.4,-1.585; 25 2.8,-1.585; 26 3.2,-1.585; 27 3.6,-1.585; 28 4,-1.585; 29 4.4,-1.585; 30 4.8,-1.585; 31 5.2,-1.585; 32 5.6,-1.585; 33 6,-1.585; 34 6.4,-1.585; 35 6.8,-1.585; 36 6.8,1.585; 37 6.4,1.585; 38 6,1.585; 39 5.6,1.585; 40 5.2,1.585; 41 4.8,1.585; 42 4.4,1.585; 43 4,1.585; 44 3.6,1.585; 45 3.2,1.585; 46 2.8,1.585; 47 2.4,1.585; 48 2,1.585; 49 1.6,1.585; 50 1.2,1.585; 51 0.8,1.585; 52 0.4,1.585; 53 0,1.585; 54 -0.4,1.585; 55 -0.8,1.585; 56 -1.2,1.585; 57 -1.6,1.585; 58 -2,1.585; 59 -2.4,1.585; 60 -2.8,1.585; 61 -3.2,1.585; 62 -3.6,1.585; 63 -4,1.585; 64 -4.4,1.585; 65 -4.8,1.585; 66 -5.2,1.585; 67 -5.6,1.585; 68 -6,1.585; 69 -6.4,1.585; 70 -6.8,1.585 | smd 0.35 x 0.75: M1 -7.275,-1.585; M2 7.275,-1.585; M3 7.275,1.585; M4 -7.275,1.585
206-124_DIP8-SPDT = drill 0.8 octagon: 1 -8.89,3.81; 2 -6.35,3.81; 3 -3.81,3.81; 4 -1.27,3.81; 5 1.27,3.81; 6 3.81,3.81; 7 6.35,3.81; 8 8.89,3.81; + -8.89,-3.81; - 8.89,-3.81
JP2 = drill 0.914 long: 1 0,0; 2 2.54,0
LXZ1 = smd 0.45 x 2: A 0.5,0; C -0.5,0
JP3 = drill 0.914 long: 1 0,0; 2 2.54,0; 3 5.08,0
RNX8-0.1 = drill 1.016: 1 2.54,0; 2 5.08,0; 3 7.62,0; 4 10.16,0; 5 12.7,0; 6 15.24,0; 7 17.78,0; 8 20.32,0 | drill 1.016 square: C 0,0
0805 = smd 0.965 x 1.524: 1 -1.041,0; 2 1.041,0
ADE_DIP8-SPST = drill 0.8 octagon: 1 -8.89,-3.81; 2 -6.35,-3.81; 3 -3.81,-3.81; 4 -1.27,-3.81; 5 1.27,-3.81; 6 3.81,-3.81; 7 6.35,-3.81; 8 8.89,-3.81; 9 8.89,3.81; 10 6.35,3.81; 11 3.81,3.81; 12 1.27,3.81; 13 -1.27,3.81; 14 -3.81,3.81; 15 -6.35,3.81; 16 -8.89,3.81
BNC_RIGHT_ANGLE = drill 2.2: P$1 0,0; P$2 10.16,0 | drill 1: P$GND 2.54,-5.08; P$SIG 5.08,-5.08
P1-20 = drill 2.007 pad 3.15 octagon: TP 0,0
4-40_PLATED = drill 3.264 pad 6.35: P$1 0,0
1X09 = drill 1.016 octagon: 1 0,0; 2 2.54,0; 3 5.08,0; 4 7.62,0; 5 10.16,0; 6 12.7,0; 7 15.24,0; 8 17.78,0; 9 -2.54,0

### Placement (x,y rotation side)
A-OR-D  79.25,105.77 180 top
B-OR-C  73.15,79.65 0 top
BANK_SELECT  82.55,11.43 0 top
CDL_A  99.82,120.01 0 top
CDL_B  52.58,65.41 180 top
D1  59.93,115.46 270 bottom
D1_EXT_A  41.21,129.6 0 top
D1_EXT_B  111.19,55.82 180 top
D2  63.27,113.14 270 bottom
D2_EXT_A  46.61,125.35 0 top
D2_EXT_B  105.79,60.07 180 top
D3  92.17,70.36 90 bottom
D4  88.73,72.68 90 bottom
GND_IMP  105.41,11.43 0 top
LED_SELECT_A  52.2,121.16 322 top
LED_SELECT_B  100.2,64.26 142 top
R1  49.53,148.59 180 top
R2  74.93,148.59 180 top
R3  100.33,148.59 180 top
R4  125.73,148.59 180 top
R5  20.32,142.24 270 top
R6  20.32,116.84 270 top
R7  132.08,93.98 90 top
R8  132.08,119.38 90 top
R9  20.32,66.04 270 top
R10  20.32,91.44 270 top
R11  132.08,68.58 90 top
R12  132.08,43.18 90 top
R13  26.67,36.83 0 top
R14  52.07,36.83 0 top
R15  77.47,36.83 0 top
R16  102.87,36.83 0 top
R17  38.1,11.43 0 top
R18  43.18,11.43 0 top
R19  38.1,6.35 90 top
R20  43.18,6.35 90 top
R_GND  110.49,5.08 180 top
R_REF  121.92,5.08 180 top
REF_TO_GND  116.84,11.43 0 top
RS_A  94.74,115.19 0 top
RS_B  57.66,70.23 180 top
S1  38.1,157.48 180 top
S2  63.5,157.48 180 top
S3  88.9,157.48 180 top
S4  114.3,157.48 180 top
S5  11.43,130.81 270 top
S6  11.43,105.41 270 top
S7  140.97,105.41 90 top
S8  140.97,130.81 90 top
S9  11.43,54.61 270 top
S10  11.43,80.01 270 top
S11  140.97,80.01 90 top
S12  140.97,54.61 90 top
S13  38.1,27.94 0 top
S14  63.5,27.94 0 top
S15  88.9,27.94 0 top
S16  114.3,27.94 0 top
SIG_GAIN  55.88,11.43 0 top
SIG_IN  25.4,6.35 180 top
TP1  8.89,11.43 0 top
TP2  133.35,35.56 0 top
TP3  19.05,149.86 0 top
TP4  133.22,149.86 0 top
TP5  34.29,92.71 0 top
TP6  118.11,92.71 0 top
TP7  8.89,16.51 0 top
TP8  33.02,7.62 0 top
TP9  48.26,7.62 0 top
TP10  5.08,5.08 0 top
TP11  147.32,5.08 0 top
TP12  5.08,163.83 0 top
TP13  147.32,163.83 0 top
TP14  106.68,124.71 0 top
TP15  45.72,60.71 0 top
U$1  46.99,144.78 180 top
U$2  72.39,144.78 180 top
U$3  97.79,144.78 180 top
U$4  123.19,144.78 180 top
U$5  24.13,139.7 270 top
U$6  24.13,114.3 270 top
U$7  128.27,96.52 90 top
U$8  128.27,121.92 90 top
U$9  24.13,63.5 270 top
U$10  24.13,88.9 270 top
U$11  128.27,71.12 90 top
U$12  128.27,45.72 90 top
U$13  29.21,40.64 0 top
U$14  54.61,40.64 0 top
U$15  80.01,40.64 0 top
U$16  105.41,40.64 0 top

### Tracks (layer width: path | path; a pad name or v marks a point on that pad's centre or on a via)
-40DB
  Top 0.305: SIG_GAIN.3 60.96,12.7 59.69,13.97 43.18,13.97 42.14,12.93 R18.1 R17.2 39.14,8.43 R19.2 33.25,7.39 TP8.TP
-80DB
  Top 0.305: SIG_GAIN.1 R18.2 44.22,8.43 R20.2 48.03,7.39 TP9.TP
AN_A
  Top 0.178: 72.45,105.03 A-OR-D.36
  Top 0.254: LED_SELECT_A.2 54.86,116.84 69.85,105.16 72.32,105.16 72.45,105.03
AN_B
  Top 0.178: 79.95,80.39 B-OR-C.36
  Top 0.254: LED_SELECT_B.2 97.54,68.58 82.55,80.26 80.08,80.26 79.95,80.39
AN_INT
  Bottom 0.254: 59.97,114.89 D1.A
  Bottom 0.406: D2.A 62.22,112.64 59.97,114.89 | D1.A 58.7,114.96 57.62,116.04 LED_SELECT_A.3
AN_INT1
  Bottom 0.254: D4.A 89.84,73.18 D3.A 93.55,70.86 96.2,68.21 LED_SELECT_B.3
CAT0_A  (via drill 0.35)
  Top 0.178: A-OR-D.34 72.85,108.71
  Top 0.254: D2_EXT_A.1 49.99,122.62 51.06,122.74 51.76,123.6 53.32,123.79 v61.2,117.71 64.56,115.11 | 64.56,115.11 72.85,108.71 | 64.56,115.11 64.52,115.11 64.52,115.19
  Bottom 0.254: D1.C v61.2,117.71
CAT0_B  (via drill 0.35)
  Top 0.178: B-OR-C.34 79.55,76.71
  Top 0.254: D2_EXT_B.1 102.41,62.8 101.34,62.68 100.64,61.82 99.08,61.63 v90.9,67.88 87.84,70.31 79.55,76.71
  Bottom 0.254: D3.C v90.9,67.88
CAT1_A  (via drill 0.35)
  Top 0.178: A-OR-D.35 72.45,108.2
  Top 0.254: 67.01,112.42 72.45,108.2 | 67.01,112.42 66.55,112.78 | D1_EXT_A.1 41.21,127.76 41.43,127.54 51.77,119.31 52.75,119.43 54.15,121.31 55.22,121.46 64.01,114.68 v64.11,114.58 67.01,112.42
  Bottom 0.254: D2.C v64.11,114.58
CAT1_B  (via drill 0.35)
  Top 0.178: 79.95,77.22 B-OR-C.35
  Top 0.254: D1_EXT_B.1 111.19,57.66 110.97,57.88 100.63,66.11 99.65,65.99 98.25,64.11 97.18,63.96 v87.93,71.15 87.69,71.34 arc0 79.95,77.22
  Bottom 0.254: D4.C v87.93,71.15
GND  (via drill 0.6)
  Top 0.305: R19.1 v38.1,3.81 | R20.1 v43.18,3.81
  pour Bottom (no thermals): -6.35,-16.51 -7.62,177.8 165.1,177.8 162.56,-13.97
HS_GND  (via drill 0.35, 0.45)
  Top 0.178: v66.29,82.14 66.35,82.11 B-OR-C.70 | A-OR-D.70 86.05,103.33 v86.11,103.28
  Top 0.406: GND_IMP.2 107.95,16.51 109.22,17.78 123.83,17.78 125.09,19.05 125.09,41.51 v122.7,43.91 | v80.01,95.12 74.55,89.66 v67.82,89.66 | v68.71,79.25 68.96,78.99 v76.82,79.09 | v100.61,77.56 v122.3,68.61
  Bottom 0.178: v66.29,82.14 66.29,81.66
  Bottom 0.254: v86.11,103.28 86.11,101.22 v80.01,95.12 | 66.29,82.04 v66.29,82.14
  Bottom 0.406: v67.82,89.66 67.82,83.69 v66.29,82.14 | 66.29,81.66 v68.71,79.25 | v122.3,68.61 122.3,44.3 v122.7,43.91 | v76.82,79.09 80.67,79.09 82.2,77.56 v100.61,77.56
ISTIM_A
  Top 0.254: A-OR-D.69 85.65,104.95 86.11,105.41 88.9,105.41 102.36,117.6 CDL_A.2 | CDL_A.2 102.36,117.86 | TP14.TP 102.36,120.4 CDL_A.2
ISTIM_B
  Top 0.178: B-OR-C.69 66.75,80.47
  Top 0.254: 50.04,65.79 50.04,67.56 | 50.04,65.79 CDL_B.2 50.04,65.79 | 50.04,65.79 50.04,67.82 63.5,80.01 63.96,80.47 66.75,80.47 | TP15.TP 50.04,65.02 50.04,65.79
N$1
  Top 0.254: CDL_A.1 97.28,117.47 RS_A.2
N$2
  Top 0.305: GND_IMP.3 R_GND.1
N$3
  Top 0.178: B-OR-C.3 67.15,76.07
  Top 0.254: 67.15,76.07 U$13.2 R13.2 S13.15
N$4
  Top 0.178: B-OR-C.5 67.95,75.31
  Top 0.254: 67.95,75.31 U$13.4 R13.4 S13.13
N$5
  Top 0.305: D2_EXT_A.2 D1_EXT_A.2
  Bottom 0.305: LED_SELECT_A.1 D2_EXT_A.2
N$6
  Top 0.178: A-OR-D.17 79.65,115.04
  Top 0.254: 79.65,115.04 U$3.8 R3.8 S3.9
N$7
  Top 0.178: A-OR-D.9 82.85,111.76
  Top 0.254: 82.85,111.76 U$4.8 R4.8 S4.9
N$8
  Top 0.178: A-OR-D.15 80.45,114.17
  Top 0.254: 80.45,114.17 U$3.6 R3.6 S3.11
N$9
  Top 0.178: A-OR-D.14 80.85,113.79
  Top 0.254: 80.85,113.79 U$3.5 R3.5 S3.12
N$10
  Top 0.178: A-OR-D.3 85.25,109.35
  Top 0.254: 85.25,109.35 U$4.2 R4.2 S4.15
N$11
  Top 0.178: A-OR-D.12 81.65,112.9
  Top 0.254: 81.65,112.9 U$3.3 R3.3 S3.14
N$12
  Top 0.178: A-OR-D.4 84.85,109.73
  Top 0.254: 84.85,109.73 U$4.3 R4.3 S4.14
N$13
  Top 0.178: A-OR-D.10 82.45,112.14
  Top 0.254: 82.45,112.14 U$3.1 R3.1 S3.16
N$14
  Top 0.254: CDL_B.1 55.12,67.94 RS_B.2
N$16
  Top 0.305: D2_EXT_B.2 D1_EXT_B.2
  Bottom 0.305: LED_SELECT_B.1 D2_EXT_B.2
N$18
  Top 0.178: A-OR-D.7 83.65,110.87
  Top 0.254: 83.65,110.87 U$4.6 R4.6 S4.11
N$19
  Top 0.178: A-OR-D.8 83.25,111.38
  Top 0.254: 83.25,111.38 U$4.7 R4.7 S4.10
N$20
  Top 0.178: A-OR-D.6 84.05,110.49
  Top 0.254: 84.05,110.49 U$4.5 R4.5 S4.12
N$21
  Top 0.178: A-OR-D.2 85.65,108.97
  Top 0.254: 85.65,108.97 U$4.1 R4.1 S4.16
N$23
  Top 0.178: A-OR-D.27 75.65,111.42
  Top 0.254: 75.65,111.42 U$1.2 R1.2 S1.15
N$24
  Top 0.178: A-OR-D.29 74.85,110.57
  Top 0.254: 74.85,110.57 U$1.4 R1.4 S1.13
N$25
  Top 0.178: A-OR-D.43 75.25,100.84 74.61,100.2 71.5,100.2 66.04,103
  Top 0.254: S5.10 R5.7 U$5.7 66.04,103
N$26
  Top 0.178: B-OR-C.7 68.75,74.55
  Top 0.254: 68.75,74.55 U$13.6 R13.6 S13.11
N$27
  Top 0.178: A-OR-D.32 73.65,109.36
  Top 0.254: 73.65,109.36 U$1.7 R1.7 S1.10
N$28
  Top 0.305: REF_TO_GND.3 R_REF.1
N$29
  Top 0.178: A-OR-D.30 74.45,110.21
  Top 0.254: 74.45,110.21 U$1.5 R1.5 S1.12
N$30
  Top 0.178: A-OR-D.41 74.45,101.6 73.81,100.96 71.5,100.96 66.04,104.27
  Top 0.254: S5.12 R5.5 U$5.5 66.04,104.27
N$31
  Top 0.178: A-OR-D.28 75.25,111.06
  Top 0.254: 75.25,111.06 U$1.3 R1.3 S1.14
N$32
  Top 0.178: B-OR-C.9 69.55,73.66
  Top 0.254: 69.55,73.66 U$13.8 R13.8 S13.9
N$33
  Top 0.178: A-OR-D.39 73.65,102.49 73.01,101.85 71.63,101.85 66.04,105.71
  Top 0.254: S5.14 R5.3 U$5.3 66.04,105.71
N$34
  Top 0.178: A-OR-D.31 74.05,109.72
  Top 0.254: 74.05,109.72 U$1.6 R1.6 S1.11
N$35
  Top 0.178: B-OR-C.10 69.95,73.28
  Top 0.254: 69.95,73.28 U$14.1 R14.1 S14.16
N$36
  Top 0.178: A-OR-D.33 73.25,109
  Top 0.254: 73.25,109 U$1.8 R1.8 S1.9
N$37
  Top 0.178: A-OR-D.37 72.85,103.25 72.21,102.62 71.88,102.62 66.04,107.16
  Top 0.254: S5.16 R5.1 U$5.1 66.04,107.16
N$38
  Top 0.178: A-OR-D.19 78.85,114.57
  Top 0.254: 78.85,114.57 U$2.2 R2.2 S2.15
N$39
  Top 0.178: A-OR-D.52 78.85,97.28 78.21,96.65 71.5,96.65 66.04,96.62
  Top 0.254: S6.9 R6.8 U$6.8 66.04,96.62
N$40
  Top 0.178: A-OR-D.21 78.05,113.85
  Top 0.254: 78.05,113.85 U$2.4 R2.4 S2.13
N$41
  Top 0.178: B-OR-C.11 70.35,72.9
  Top 0.254: 70.35,72.9 U$14.2 R14.2 S14.15
N$42
  Top 0.178: A-OR-D.23 77.25,113
  Top 0.254: 77.25,113 U$2.6 R2.6 S2.11
N$43
  Top 0.178: A-OR-D.24 76.85,112.64
  Top 0.254: 76.85,112.64 U$2.7 R2.7 S2.10
N$45
  Top 0.178: B-OR-C.14 71.55,71.63
  Top 0.254: 71.55,71.63 U$14.5 R14.5 S14.12
N$46
  Top 0.178: B-OR-C.15 71.95,71.25
  Top 0.254: 71.95,71.25 U$14.6 R14.6 S14.11
N$47
  Top 0.178: A-OR-D.47 76.85,99.19 76.21,98.55 71.5,98.55 66.04,99.8
  Top 0.254: S6.14 R6.3 U$6.3 66.04,99.8
N$48
  Top 0.178: B-OR-C.16 72.35,70.87
  Top 0.254: 72.35,70.87 U$14.7 R14.7 S14.10
N$49
  Top 0.178: B-OR-C.19 73.55,70.85
  Top 0.254: 73.55,70.85 U$15.2 R15.2 S15.15
N$50
  Top 0.178: B-OR-C.20 73.95,71.21
  Top 0.254: 73.95,71.21 U$15.3 R15.3 S15.14
N$51
  Top 0.178: B-OR-C.21 74.35,71.57
  Top 0.254: 74.35,71.57 U$15.4 R15.4 S15.13
N$52
  Top 0.178: B-OR-C.22 74.75,72.06
  Top 0.254: 74.75,72.06 U$15.5 R15.5 S15.12
N$53
  Top 0.178: B-OR-C.23 75.15,72.42
  Top 0.254: 75.15,72.42 U$15.6 R15.6 S15.11
N$54
  Top 0.178: B-OR-C.24 75.55,72.78
  Top 0.254: 75.55,72.78 U$15.7 R15.7 S15.10
N$55
  Top 0.178: B-OR-C.25 75.95,73.15
  Top 0.254: 75.95,73.15 U$15.8 R15.8 S15.9
N$56
  Top 0.178: B-OR-C.26 76.35,73.63
  Top 0.254: 76.35,73.63 U$16.1 R16.1 S16.16
N$57
  Top 0.178: A-OR-D.53 79.25,97.28 79.88,96.65 87,96.65 91.44,96.62
  Top 0.254: 91.44,96.62 U$7.1 R7.1 S7.16
N$58
  Top 0.178: B-OR-C.27 76.75,74
  Top 0.254: 76.75,74 U$16.2 R16.2 S16.15
N$59
  Top 0.178: B-OR-C.28 77.15,74.36
  Top 0.254: 77.15,74.36 U$16.3 R16.3 S16.14
N$60
  Top 0.178: B-OR-C.29 77.55,74.85
  Top 0.254: 77.55,74.85 U$16.4 R16.4 S16.13
N$61
  Top 0.178: B-OR-C.30 77.95,75.21
  Top 0.254: 77.95,75.21 U$16.5 R16.5 S16.12
N$62
  Top 0.178: B-OR-C.31 78.35,75.7
  Top 0.254: 78.35,75.7 U$16.6 R16.6 S16.11
N$63
  Top 0.178: B-OR-C.32 78.75,76.06
  Top 0.254: 78.75,76.06 U$16.7 R16.7 S16.10
N$64
  Top 0.178: B-OR-C.33 79.15,76.42
  Top 0.254: 79.15,76.42 U$16.8 R16.8 S16.9
N$65
  Top 0.178: B-OR-C.8 69.15,74.04
  Top 0.254: 69.15,74.04 U$13.7 R13.7 S13.10
N$66
  Top 0.178: B-OR-C.6 68.35,74.93
  Top 0.254: 68.35,74.93 U$13.5 R13.5 S13.12
N$67
  Top 0.178: B-OR-C.4 67.55,75.69
  Top 0.254: 67.55,75.69 U$13.3 R13.3 S13.14
N$68
  Top 0.178: B-OR-C.2 66.75,76.45
  Top 0.254: 66.75,76.45 U$13.1 R13.1 S13.16
N$69
  Top 0.178: B-OR-C.17 72.75,70.38
  Top 0.254: 72.75,70.38 U$14.8 R14.8 S14.9
N$70
  Top 0.178: B-OR-C.12 70.75,72.52
  Top 0.254: 70.75,72.52 U$14.3 R14.3 S14.14
N$71
  Top 0.178: B-OR-C.18 73.15,70.48
  Top 0.254: 73.15,70.48 U$15.1 R15.1 S15.16
N$72
  Top 0.178: B-OR-C.61 69.95,85.09 69.32,85.72 65.41,85.72 60.96,83.34
  Top 0.254: 60.96,83.34 U$9.1 R9.1 S9.16
N$73
  Top 0.178: B-OR-C.60 70.35,85.47 69.72,86.11 65.41,86.11 60.96,84.51
  Top 0.254: 60.96,84.51 U$10.8 R10.8 S10.9
N$74
  Top 0.178: B-OR-C.57 71.55,86.61 70.92,87.25 65.41,87.25 60.96,86.33
  Top 0.254: 60.96,86.33 U$10.5 R10.5 S10.12
N$75
  Top 0.178: B-OR-C.55 72.35,87.38 71.72,88.01 65.41,88.01 60.96,87.55
  Top 0.254: 60.96,87.55 U$10.3 R10.3 S10.14
N$76
  Top 0.178: B-OR-C.53 73.15,88.14 72.52,88.77 65.41,88.77 60.96,88.8
  Top 0.254: 60.96,88.8 U$10.1 R10.1 S10.16
N$77
  Top 0.178: B-OR-C.51 73.95,87.76 74.59,88.39 80.9,88.39 86.36,88.16
  Top 0.254: S11.10 R11.7 U$11.7 86.36,88.16
N$78
  Top 0.178: B-OR-C.48 75.15,86.61 75.79,87.25 80.9,87.25 86.36,86.28
  Top 0.254: S11.13 R11.4 U$11.4 86.36,86.28
N$79
  Top 0.178: B-OR-C.46 75.95,85.85 76.59,86.49 80.9,86.49 86.36,85.01
  Top 0.254: S11.15 R11.2 U$11.2 86.36,85.01
N$80
  Top 0.178: B-OR-C.40 78.35,83.31 78.99,83.95 80.9,83.95 86.36,80.42
  Top 0.254: S12.13 R12.4 U$12.4 86.36,80.42
N$81
  Top 0.178: B-OR-C.52 73.55,88.14 74.19,88.77 80.9,88.77 86.36,88.8
  Top 0.254: S11.9 R11.8 U$11.8 86.36,88.8
N$82
  Top 0.178: B-OR-C.50 74.35,87.38 74.99,88.01 80.9,88.01 86.36,87.53
  Top 0.254: S11.11 R11.6 U$11.6 86.36,87.53
N$83
  Top 0.178: B-OR-C.49 74.75,86.99 75.39,87.63 80.9,87.63 86.36,86.89
  Top 0.254: S11.12 R11.5 U$11.5 86.36,86.89
N$84
  Top 0.178: B-OR-C.47 75.55,86.23 76.19,86.87 80.9,86.87 86.36,85.62
  Top 0.254: S11.14 R11.3 U$11.3 86.36,85.62
N$85
  Top 0.178: B-OR-C.45 76.35,85.34 76.99,85.98 80.9,85.98 86.36,84.28
  Top 0.254: S11.16 R11.1 U$11.1 86.36,84.28
N$86
  Top 0.178: B-OR-C.67 67.55,82.68 66.92,83.31 66.04,83.31 60.96,79.53
  Top 0.254: 60.96,79.53 U$9.7 R9.7 S9.10
N$87
  Top 0.178: B-OR-C.65 68.35,83.44 67.72,84.07 65.79,84.07 60.96,80.77
  Top 0.254: 60.96,80.77 U$9.5 R9.5 S9.12
N$88
  Top 0.178: B-OR-C.63 69.15,84.2 68.52,84.84 65.41,84.84 60.96,81.99
  Top 0.254: 60.96,81.99 U$9.3 R9.3 S9.14
N$89
  Top 0.178: B-OR-C.44 76.75,84.96 77.39,85.6 80.9,85.6 86.36,83.06
  Top 0.254: S12.9 R12.8 U$12.8 86.36,83.06
N$90
  Top 0.178: B-OR-C.38 79.15,82.55 79.79,83.18 80.65,83.18 86.36,78.99
  Top 0.254: S12.15 R12.2 U$12.2 86.36,78.99
N$91
  Top 0.178: B-OR-C.39 78.75,82.93 79.39,83.57 80.77,83.57 86.36,79.7
  Top 0.254: S12.14 R12.3 U$12.3 86.36,79.7
N$92
  Top 0.178: B-OR-C.42 77.55,84.2 78.19,84.84 80.9,84.84 86.36,81.79
  Top 0.254: S12.11 R12.6 U$12.6 86.36,81.79
N$93
  Top 0.178: B-OR-C.43 77.15,84.58 77.79,85.22 80.9,85.22 86.36,82.42
  Top 0.254: S12.10 R12.7 U$12.7 86.36,82.42
N$94
  Top 0.178: B-OR-C.41 77.95,83.82 78.59,84.45 80.9,84.45 86.36,81.15
  Top 0.254: S12.12 R12.5 U$12.5 86.36,81.15
N$95
  Top 0.178: B-OR-C.37 79.55,82.17 80.19,82.8 80.52,82.8 86.36,78.26
  Top 0.254: S12.16 R12.1 U$12.1 86.36,78.26
N$97
  Top 0.178: B-OR-C.64 68.75,83.82 68.12,84.45 65.53,84.45 60.94,81.38
  Top 0.254: 60.94,81.38 U$9.4 R9.4 S9.13
N$98
  Top 0.178: B-OR-C.66 67.95,83.06 67.32,83.69 65.91,83.69 60.94,80.14
  Top 0.254: 60.94,80.14 U$9.6 R9.6 S9.11
N$99
  Top 0.178: B-OR-C.68 67.15,82.17 66.52,82.8 66.17,82.8 60.98,78.82
  Top 0.254: 60.98,78.82 U$9.8 R9.8 S9.9
N$100
  Top 0.178: B-OR-C.54 72.75,87.76 72.12,88.39 65.41,88.39 60.96,88.16
  Top 0.254: 60.96,88.16 U$10.2 R10.2 S10.15
N$101
  Top 0.178: B-OR-C.56 71.95,86.99 71.32,87.63 65.41,87.63 60.96,86.94
  Top 0.254: 60.96,86.94 U$10.4 R10.4 S10.13
N$102
  Top 0.178: B-OR-C.58 71.15,86.23 70.52,86.87 65.41,86.87 60.96,85.72
  Top 0.254: 60.96,85.72 U$10.6 R10.6 S10.11
N$103
  Top 0.178: B-OR-C.59 70.75,85.85 70.12,86.49 65.41,86.49 60.96,85.11
  Top 0.254: 60.96,85.11 U$10.7 R10.7 S10.10
N$110
  Top 0.178: B-OR-C.13 71.15,72.01
  Top 0.254: 71.15,72.01 U$14.4 R14.4 S14.13
N$130
  Top 0.178: B-OR-C.62 69.55,84.71 68.92,85.34 65.41,85.34 60.94,82.7
  Top 0.254: 60.94,82.7 U$9.2 R9.2 S9.15
N$206
  Top 0.178: A-OR-D.26 76.05,111.78
  Top 0.254: 76.05,111.78 U$1.1 R1.1 S1.16
N$207
  Top 0.178: A-OR-D.25 76.45,112.27
  Top 0.254: 76.45,112.27 U$2.8 R2.8 S2.9
N$210
  Top 0.178: A-OR-D.22 77.65,113.36
  Top 0.254: 77.65,113.36 U$2.5 R2.5 S2.12
N$212
  Top 0.178: A-OR-D.20 78.45,114.21
  Top 0.254: 78.45,114.21 U$2.3 R2.3 S2.14
N$214
  Top 0.178: A-OR-D.18 79.25,114.94
  Top 0.254: 79.25,114.94 U$2.1 R2.1 S2.16
N$216
  Top 0.178: A-OR-D.16 80.05,114.55
  Top 0.254: 80.05,114.55 U$3.7 R3.7 S3.10
N$219
  Top 0.178: A-OR-D.13 81.25,113.41
  Top 0.254: 81.25,113.41 U$3.4 R3.4 S3.13
N$221
  Top 0.178: A-OR-D.11 82.05,112.52
  Top 0.254: 82.05,112.52 U$3.2 R3.2 S3.15
N$230
  Top 0.178: A-OR-D.5 84.45,110.11
  Top 0.254: 84.45,110.11 U$4.4 R4.4 S4.13
N$231
  Top 0.178: A-OR-D.38 73.25,102.87 72.61,102.23 71.75,102.23 66.04,106.43
  Top 0.254: S5.15 R5.2 U$5.2 66.04,106.43
N$233
  Top 0.178: A-OR-D.40 74.05,102.11 73.41,101.47 71.5,101.47 66.04,105
  Top 0.254: S5.13 R5.4 U$5.4 66.04,105
N$235
  Top 0.178: A-OR-D.42 74.85,101.22 74.21,100.58 71.5,100.58 66.04,103.63
  Top 0.254: S5.11 R5.6 U$5.6 66.04,103.63
N$237
  Top 0.178: A-OR-D.44 75.65,100.46 75.01,99.82 71.5,99.82 66.04,102.36
  Top 0.254: S5.9 R5.8 U$5.8 66.04,102.36
N$238
  Top 0.178: A-OR-D.45 76.05,100.08 75.41,99.44 71.5,99.44 66.04,101.14
  Top 0.254: S6.16 R6.1 U$6.1 66.04,101.14
N$239
  Top 0.178: A-OR-D.46 76.45,99.57 75.81,98.93 71.5,98.93 66.04,100.41
  Top 0.254: S6.15 R6.2 U$6.2 66.04,100.41
N$241
  Top 0.178: A-OR-D.48 77.25,98.81 76.61,98.17 71.5,98.17 66.04,99.14
  Top 0.254: S6.13 R6.4 U$6.4 66.04,99.14
N$242
  Top 0.178: A-OR-D.49 77.65,98.42 77.01,97.79 71.5,97.79 66.04,98.53
  Top 0.254: S6.12 R6.5 U$6.5 66.04,98.53
N$243
  Top 0.178: A-OR-D.50 78.05,98.04 77.41,97.41 71.5,97.41 66.04,97.89
  Top 0.254: S6.11 R6.6 U$6.6 66.04,97.89
N$245
  Top 0.178: A-OR-D.51 78.45,97.66 77.81,97.03 71.5,97.03 66.04,97.26
  Top 0.254: S6.10 R6.7 U$6.7 66.04,97.26
N$247
  Top 0.178: A-OR-D.54 79.65,97.66 80.28,97.03 87,97.03 91.44,97.26
  Top 0.254: 91.44,97.26 U$7.2 R7.2 S7.15
N$248
  Top 0.178: A-OR-D.55 80.05,98.04 80.68,97.41 87,97.41 91.44,97.87
  Top 0.254: 91.44,97.87 U$7.3 R7.3 S7.14
N$249
  Top 0.178: A-OR-D.56 80.45,98.42 81.08,97.79 87,97.79 91.44,98.48
  Top 0.254: 91.44,98.48 U$7.4 R7.4 S7.13
N$250
  Top 0.178: A-OR-D.57 80.85,98.81 81.48,98.17 87,98.17 91.44,99.08
  Top 0.254: 91.44,99.08 U$7.5 R7.5 S7.12
N$251
  Top 0.178: A-OR-D.58 81.25,99.19 81.88,98.55 87,98.55 91.44,99.69
  Top 0.254: 91.44,99.69 U$7.6 R7.6 S7.11
N$252
  Top 0.178: A-OR-D.59 81.65,99.57 82.28,98.93 87,98.93 91.44,100.3
  Top 0.254: 91.44,100.3 U$7.7 R7.7 S7.10
N$253
  Top 0.178: A-OR-D.60 82.05,99.95 82.68,99.31 87,99.31 91.44,100.91
  Top 0.254: 91.44,100.91 U$7.8 R7.8 S7.9
N$254
  Top 0.178: A-OR-D.61 82.45,100.33 83.08,99.69 87,99.69 91.44,102.08
  Top 0.254: 91.44,102.08 U$8.1 R8.1 S8.16
N$255
  Top 0.178: A-OR-D.62 82.85,100.71 83.48,100.08 87,100.08 91.47,102.72
  Top 0.254: 91.47,102.72 U$8.2 R8.2 S8.15
N$256
  Top 0.178: A-OR-D.63 83.25,101.22 83.88,100.58 87,100.58 91.44,103.43
  Top 0.254: 91.44,103.43 U$8.3 R8.3 S8.14
N$257
  Top 0.178: A-OR-D.64 83.65,101.6 84.28,100.96 86.87,100.96 91.47,104.04
  Top 0.254: 91.47,104.04 U$8.4 R8.4 S8.13
N$258
  Top 0.178: A-OR-D.65 84.05,101.98 84.68,101.35 86.61,101.35 91.44,104.65
  Top 0.254: 91.44,104.65 U$8.5 R8.5 S8.12
N$259
  Top 0.178: A-OR-D.66 84.45,102.36 85.08,101.73 86.49,101.73 91.47,105.28
  Top 0.254: 91.47,105.28 U$8.6 R8.6 S8.11
N$260
  Top 0.178: A-OR-D.67 84.85,102.74 85.48,102.11 86.36,102.11 91.44,105.89
  Top 0.254: 91.44,105.89 U$8.7 R8.7 S8.10
N$261
  Top 0.178: A-OR-D.68 85.25,103.25 85.88,102.62 86.23,102.62 91.42,106.6
  Top 0.254: 91.42,106.6 U$8.8 R8.8 S8.9
REF  (via drill 0.35, 0.45)
  Top 0.254: RS_A.1 arc-90 94.62,115.06 93.22,115.06 86.05,108.65 A-OR-D.1 86.05,106.62 v85.34,105.92 | 66.35,77.98 B-OR-C.1 66.35,79.01 v66.42,79.07 66.42,78.99 | 66.35,77.98 66.35,76.77 59.18,70.36 57.79,70.36 arc90 RS_B.1 | 66.36,77.98 66.35,77.98
  Top 0.406: v66.42,89.66 67.37,90.61 73.72,90.61 v79.12,96.01 | v66.42,79.07 66.73,79.68 68.14,79.68 68.41,79.96 69,79.96 69.07,79.88 v75.48,79.88 | REF_TO_GND.2 119.38,14.99 121.08,16.69 124.61,16.69 126.62,18.69 126.62,43.7 v124.94,45.38 | v98.9,79.31 v124.8,69.91
  Bottom 0.254: v85.34,105.92 79.38,105.92 79.25,105.79 79.25,96.14 v79.12,96.01
  Bottom 0.406: v66.42,89.66 65.41,88.65 65.41,80.09 v66.42,79.07 | v98.9,79.31 arc90 98.82,79.39 82.46,79.39 81.97,79.88 v75.48,79.88 | v124.8,69.91 124.8,45.38 v124.94,45.38
SIG
  Top 0.305: SIG_GAIN.2 58.42,8.89 59.69,7.62 BANK_SELECT.+
SIG_IN
  Top 0.254: TP7.TP 19.05,16.51 20.32,15.24 20.32,13.97 | 20.32,13.97 SIG_IN.P$SIG | 21.59,13.97 20.32,13.97
  Top 0.305: SIG_IN.P$SIG 20.32,12.7 | 21.59,13.97 35.79,13.97 37.06,12.7 R17.1
SIG_N_15-0
  Top 0.254: 141.61,119.38 141.61,156.84 140.34,158.12 12.06,158.12 10.8,156.84 10.8,27.3 12.06,26.03 47.62,26.03 48.9,24.77 48.9,19.05 50.17,17.78 69.22,17.78 70.48,16.51 70.48,13.97 71.75,12.7 80.01,12.7 81.28,13.97 BANK_SELECT.4 | 141.61,119.38 R8.C | R7.C 140.34,93.98 141.61,95.25 141.61,119.38
SIG_N_31-16
  Top 0.254: 12.7,116.84 12.7,29.21 13.97,27.94 49.53,27.94 50.8,26.67 50.8,20.95 52.07,19.68 71.12,19.68 73.66,17.14 77.47,17.14 78.74,15.88 BANK_SELECT.3 | 12.7,116.84 12.7,140.97 13.97,142.24 R5.C | R6.C 12.7,116.84
SIG_N_47-32
  Top 0.254: 49.53,156.84 13.34,156.84 12.06,155.57 12.06,28.57 13.34,27.3 48.9,27.3 50.17,26.03 50.17,20.32 51.44,19.05 70.48,19.05 71.75,17.78 71.75,15.24 73.03,13.97 74.93,13.97 BANK_SELECT.2 | 49.53,156.84 73.66,156.84 74.93,155.57 R2.C | R1.C 49.53,156.84
SIG_N_63-48
  Top 0.254: 100.33,157.48 12.7,157.48 11.43,156.21 11.43,27.94 12.7,26.67 48.26,26.67 49.53,25.4 49.53,19.68 50.8,18.41 69.85,18.41 71.12,17.14 71.12,14.6 72.39,13.33 76.2,13.33 77.47,14.6 77.47,15.88 76.84,16.51 74.3,16.51 73.66,15.88 BANK_SELECT.1 | 100.33,157.48 R3.C | R4.C 125.73,156.21 124.46,157.48 100.33,157.48
SIG_S_15-0
  Top 0.254: 13.34,66.04 13.34,29.84 14.61,28.57 50.17,28.57 51.44,27.3 51.44,21.59 52.7,20.32 71.75,20.32 74.3,17.78 90.17,17.78 91.44,16.51 BANK_SELECT.8 | 13.34,66.04 13.34,90.17 14.61,91.44 R10.C | R9.C 13.34,66.04
SIG_S_31-16
  Top 0.254: 142.24,68.58 142.24,157.48 140.97,158.75 11.43,158.75 10.16,157.48 10.16,26.67 11.43,25.4 46.99,25.4 48.26,24.13 48.26,18.41 49.53,17.14 68.58,17.14 69.85,15.88 69.85,13.33 71.12,12.06 81.28,12.06 82.55,13.33 82.55,15.88 83.82,17.14 88.27,17.14 88.9,16.51 BANK_SELECT.7 | 142.24,68.58 R11.C | R12.C 140.97,43.18 142.24,44.45 142.24,68.58
SIG_S_47-32
  Top 0.254: 77.47,27.94 77.47,20.32 78.74,19.05 92.08,19.05 93.34,17.78 93.34,13.97 92.71,13.33 87.63,13.33 86.36,14.6 BANK_SELECT.6 | R16.C 102.87,27.94 77.47,27.94 | 77.47,27.94 R15.C
SIG_S_63-48
  Top 0.254: 52.07,29.21 52.07,22.22 53.34,20.95 72.39,20.95 74.93,18.41 91.44,18.41 92.71,17.14 92.71,14.6 92.08,13.97 88.27,13.97 87.63,14.6 87.63,15.88 87,16.51 84.45,16.51 83.82,15.88 BANK_SELECT.5 | 52.07,29.21 R14.C | R13.C 26.67,29.21 52.07,29.21

### Text on the board
tPlace: N32 | N39 | N40 | N47 | N48 | N55 | N56 | N63 | TT07 | TT06 | TT05 | TT04 | TT03 | TT02 | TT01 | TT00 | GND | GND | GND | GND | GND | N31 | N00 | TT15 | TT08 | TT14 | TT09 | EXT | N24 | N07 | GND | NORTH / (Amp A/D) | GND | INT | N23 | N08 | TT10 | TT13 | TT12 | TT11 | N16 | N15 | GND | HEADSTAGE-128 / -or- / HEADSTAGE-256 | To test amps C and D, / rotate headstage 90 Deg. | GND | S15 | S16 | TT27 | TT28 | TT29 | TT26 | S08 | S23 | INT | GND | SOUTH / (Amp B/C) | GND | S07 | S24 | EXT | TT25 | TT30 | TT24 | TT31 | S00 | S31 | GND | GND | GND | GND | GND | 128/256 Channel / Headstage Module / Test Board | Rev. 1.2 / CERN OHL v1.2 / JPN, MWL@MIT / 2017 | TT16 | TT17 | TT18 | TT19 | TT20 | TT21 | TT22 | TT23 | S63 | S56 | S55 | S48 | S47 | S40 | S39 | S32 | NC | -80dB | -40dB | N_63-48 | N_47-32 | N_31-16 | N_00-15 | S_63-48 | S_47-32 | S_31-16 | S_00-15